# Altium project RpiNeoCore_Display.PrjPcb (part 2 of 3)

## Sheet AlarmRelay.SchDoc
size A3; SheetNumber: 6; SheetTotal: 11
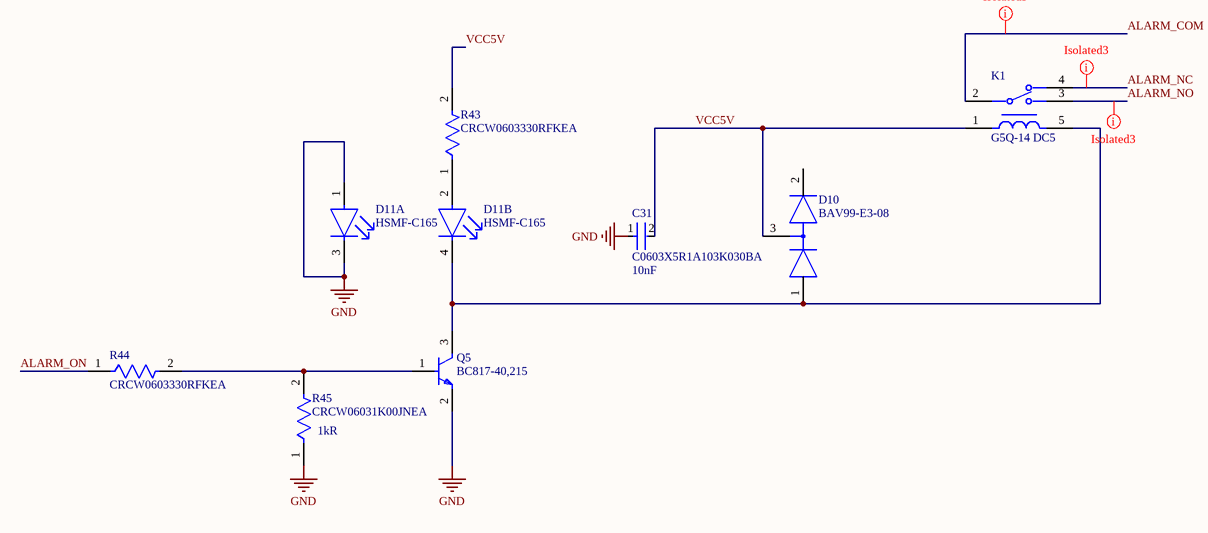
[diagram p5: AlarmRelay.SchDoc]

### Parts
C31  C0603X5R1A103K030BA  Capacitance: 10nF  [FP-C0603-030-0_03-MFG]
D10  BAV99-E3-08  [FP-6_541-5014_01-4-MFG]
D11  HSMF-C165  [FP-HSMF-C165-MFG]  (parts A,B of 2)
K1  G5Q-14 DC5  [FP-G5Q-14_DC5-MFG]
Q5  BC817-40,215  [FP-SOT23-MFG]
R43  CRCW0603330RFKEA  [FP-CRCW0603-e3-MFG]
R44  CRCW0603330RFKEA  [FP-CRCW0603-e3-MFG]
R45  CRCW06031K00JNEA  Resistance: 1kR  [FP-CRCW0603-e3-IPC_C]

### Nets
GND: C31.1 D11.1(GREEN_A) D11.3(GREEN_C) Q5.2(E) R45.1
ALARM_COM: K1.2
ALARM_NC: K1.4
ALARM_NO: K1.3
ALARM_ON: R44.1
VCC5V: C31.2 D10.3 K1.1 R43.2
NetD10_1: D10.1 D11.4(RED_C) K1.5 Q5.3(C)
NetD11_2: D11.2(RED_A) R43.1
NetQ5_1: Q5.1(B) R44.2 R45.2

Not connected (* = marked no-connect by the designer): D10 2

### Layout directives
net class Isolated3: ALARM_COM, ALARM_NC, ALARM_NO

### Library data of the parts
C31 = CMP-08246-002714-1: Multilayer Ceramic Capacitors 10nF ±10% 10V X5R SMD 0201; Dissipation Factor: 5%; Case Code (Imperial): 0201; Tolerance: 10%; Voltage: 10V; Case/Package: 0201; Width: 0.012inch; Series: C; Construction: Flat; Lead Free: Lead Free; Dielectric: X5R; Depth: 0.3mm; Mount: Surface Mount; Number of Pins: 2; Voltage Rating (DC): 10V; Radiation Hardening: No; Length: 0.6mm; Resistor Type: Ceramic; Dielectric Material: Ceramic; Packaging: Tape and Reel; Height: 0.3mm; Package Quantity: 1; RoHS Compliant: Yes; Thickness: 0.013inch; Min Operating Temperature: -55°C; Voltage Rating: 10V; Case Code (Metric): 0603; Weight: 6E-06oz; Max Operating Temperature: 85°C; Termination: SMD/SMT
D10 = CMP-02540-000013-1: DIODE ARRAY GP 70V 150MA SOT23; Manufacturer: Vishay; Max Surge Forward Current: 1A; Value: 1.5pF; Max Junction Temp: +150°C; Automotive Grade: NA; Forward Current: 250mA; Peak Reverse Current: 2.5uA; Digikey Description: DIODE ARRAY GP 70V 150MA SOT23; Device Class L2: Diodes; Category: Diode; Temperature: -55°C to +150°C; Octopart: https://octopart.com/bav99-e3-08-vishay-46456629; Temperature Range Low: -55°C; Package: 6.541-5014.01-4; ComponentLink2Description: Datasheet; RoHS: TRUE; ComponentLink2URL: http://www.vishay.com/docs/85718/bav99.pdf; Ipc Land Pattern Name: SOT95P248X102-3; Height: 1.15mm; Reverse Voltage: 70V; Capacitance: 1.5pF; Automotive: No; Temperature Range High: +150°C; Device Class L1: Discrete Semiconductors; Mouser Description: Diodes - General Purpose, Power, Switching 70V 250mA 4.5A IFSM Dual Series; Manufacturer Part Number: BAV99-E3-08; Lead Free: Yes; Device Class L3: Rectifier Diodes; Max Repetitive Reverse Voltage: 70V
D11 = CMP-2000-06424-2: LED GREEN/RED DIFFUSED 0603 SMD; Reverse Voltage: 5V; Dominant Wavelength: 621nm; Number of Elements: 2; Shape: Rectangular; Luminous Intensity: 10mcd; Forward Current: 20mA; Lens Color: White; Illumination Color: Green; Power Dissipation: 52mW; Wavelength: 572nm; Viewing Angle: 120°; Forward Voltage: 2.2V; Max Operating Temperature: 85°C; Lens Transparency: Diffused; Width: 0.8mm; Case/Package: 0603; Packaging: Tape and Reel; Case Code (Metric): 1608; Depth: 0.8mm; REACH SVHC: No SVHC; Number of LEDs: 2; Radiation Hardening: No; Lens Style: Rectangular; Color: Green; Case Code (Imperial): 0603; Min Operating Temperature: -40°C; Power Rating: 52mW; Number of Pins: 4; Number of Terminals: 4; Package Quantity: 1; Mount: Surface Mount; Height: 0.5mm; Length: 1.6mm; Lead Free: Lead Free; Test Current: 20mA
K1 = CMP-08822-000014-1: RELAY GEN PURPOSE SPDT 10A 5V; Manufacturer: Omron; Coil Type: Non-Latching; Coil Resistance: 63Ω; Number Of Contacts: 1; Coil Power: 400mW; Coil Current: 80mA; Standoff Height: 0.4mm; Device Class L2: Relays; Octopart: https://octopart.com/g5q-14+dc5-omron-71281; RoHS: TRUE; Temperature: -40°C to +105°C; Temperature Range High: +105°C; Category: Relay; ComponentLink2Description: Datasheet; Device Class L1: Electromechanical; Manufacturer Part Number: G5Q-14 DC5; ComponentLink2URL: https://omronfs.omron.com/en_US/ecb/products/pdf/en-g5q.pdf; Height: 16.2mm; Throw Configuration: SPDT; Current Rating: 10A; Mouser Description: Power Relay 5VDC 5(NO)/3(NC)DC/10(NO)/3(NC)AAC SPDT (20.3MM 10.3MM 16.2MM) Tht; Automotive: No; Device Class L3: Power Relays; Lead Free: Yes; Digikey Description: RELAY GEN PURPOSE SPDT 10A 5V; Package: 0; Coil Voltage: 5V; Temperature Range Low: -40°C; Ambient Temperature Range High: +105°C; Ambient Temperature Range Low: -40°C; Switching Current: 10A
Q5 = CMP-14406-000007-1: TRANS NPN 45V 0.5A SOT23; Manufacturer: Nexperia; Collector Emitter Saturation Voltage: 700mV; Power Dissipation: 250mW; Collector Base Voltage: 50V; Unity Gain Freq: 100MHz; Hfe Max: 600; Rthja Max: 500K/W; Emitter Base Voltage: 5V; Max Collector Current: 500mA; Hfe Testvce: 1V; Automotive Grade: Grade 0; Hfe Min: 250; Max Junction Temp: +150°C; Number Of Npn: 1; Hfe Testic: 100mA; Octopart: https://octopart.com/bc817-40%2C215-nexperia-78739081; Lead Free: Yes; Ipc Land Pattern Name: SOT95P230X100-3; Manufacturer Part Number: BC817-40,215; RoHS: TRUE; Collector Emitter Breakdown Voltage: 45V; Digikey Description: TRANS NPN 45V 0.5A SOT23; ComponentLink2URL: https://assets.nexperia.com/documents/data-sheet/BC817_SER.pdf; Temperature Range High: +150°C; Mouser Description: BC817 Series 45 V 500 mA 250 mW SMT NPN General-Purpose Transistor - SOT-23-; Device Class L3: BJTs; Temperature: to +150°C; Height: 1.1mm; Automotive: Yes; Ambient Temperature Range Low: -65°C; Package: SOT23; Collector Emitter Voltage: 45V; Category: Trans; ComponentLink2Description: Datasheet; Device Class L2: Transistors; Ambient Temperature Range High: +150°C; Number Of Elements: 1; Device Class L1: Discrete Semiconductors; Footprint Url: https://assets.nexperia.com/documents/outline-drawing/SOT23.pdf
R43 R44 = CMP-1012-00454-3: RES Thick Film, 330Ω, 1%, 0.1W, 100ppm/°C, 0603; Voltage Rating: 75V; Max Power Dissipation: 100mW; Resistance: 330R; Depth: 0.85mm; Contact Plating: Tin; Package Quantity: 10; Termination: SMD/SMT; Tolerance: 1%; Height: 0.45mm; Number of Terminations: 2; Radiation Hardening: No; Features: Automotive AEC-Q200; Case/Package: 0603; Mount: Surface Mount; Case Code (Metric): 1608; Lead Free: Lead Free; Temperature Coefficient: 100ppm/°C; Weight: 7.1E-05oz; Military Standard: Not; Packaging: Tape and Reel; Max Operating Temperature: 155°C; Voltage Rating (DC): 75V; Length: 1.55mm; Min Operating Temperature: -55°C; Composition: Thick Film; Case Code (Imperial): 0603; Width: 0.033inch; Power Rating: 100mW
R45 = CMP-02407-007100-1: RES Thick Film, 1kΩ, 5%, 0.1W, 200ppm/°C, 0603; Power Rating: 100mW; Voltage Rating: 75V; Height: 0.02inch; Number of Terminations: 2; Radiation Hardening: No; Max Operating Temperature: 155°C; Packaging: Tape and Reel; Package Quantity: 1; Military Standard: Not; Case/Package: 0603; Weight: 7.1E-05oz; Tolerance: 5%; Temperature Coefficient: 200ppm/°C; Termination: SMD/SMT; Case Code (Metric): 1608; Length: 1.55mm; Min Operating Temperature: -55°C; Depth: 0.85mm; Composition: Thick Film; Width: 0.033inch; Number of Pins: 2; Contact Plating: Tin; Max Power Dissipation: 100mW; Voltage Rating (DC): 75V; Case Code (Imperial): 0603; Lead Free: Lead Free; Features: Automotive AEC-Q200

## Sheet AnalogInputs.SchDoc
size A3; SheetNumber: 7; SheetTotal: 11
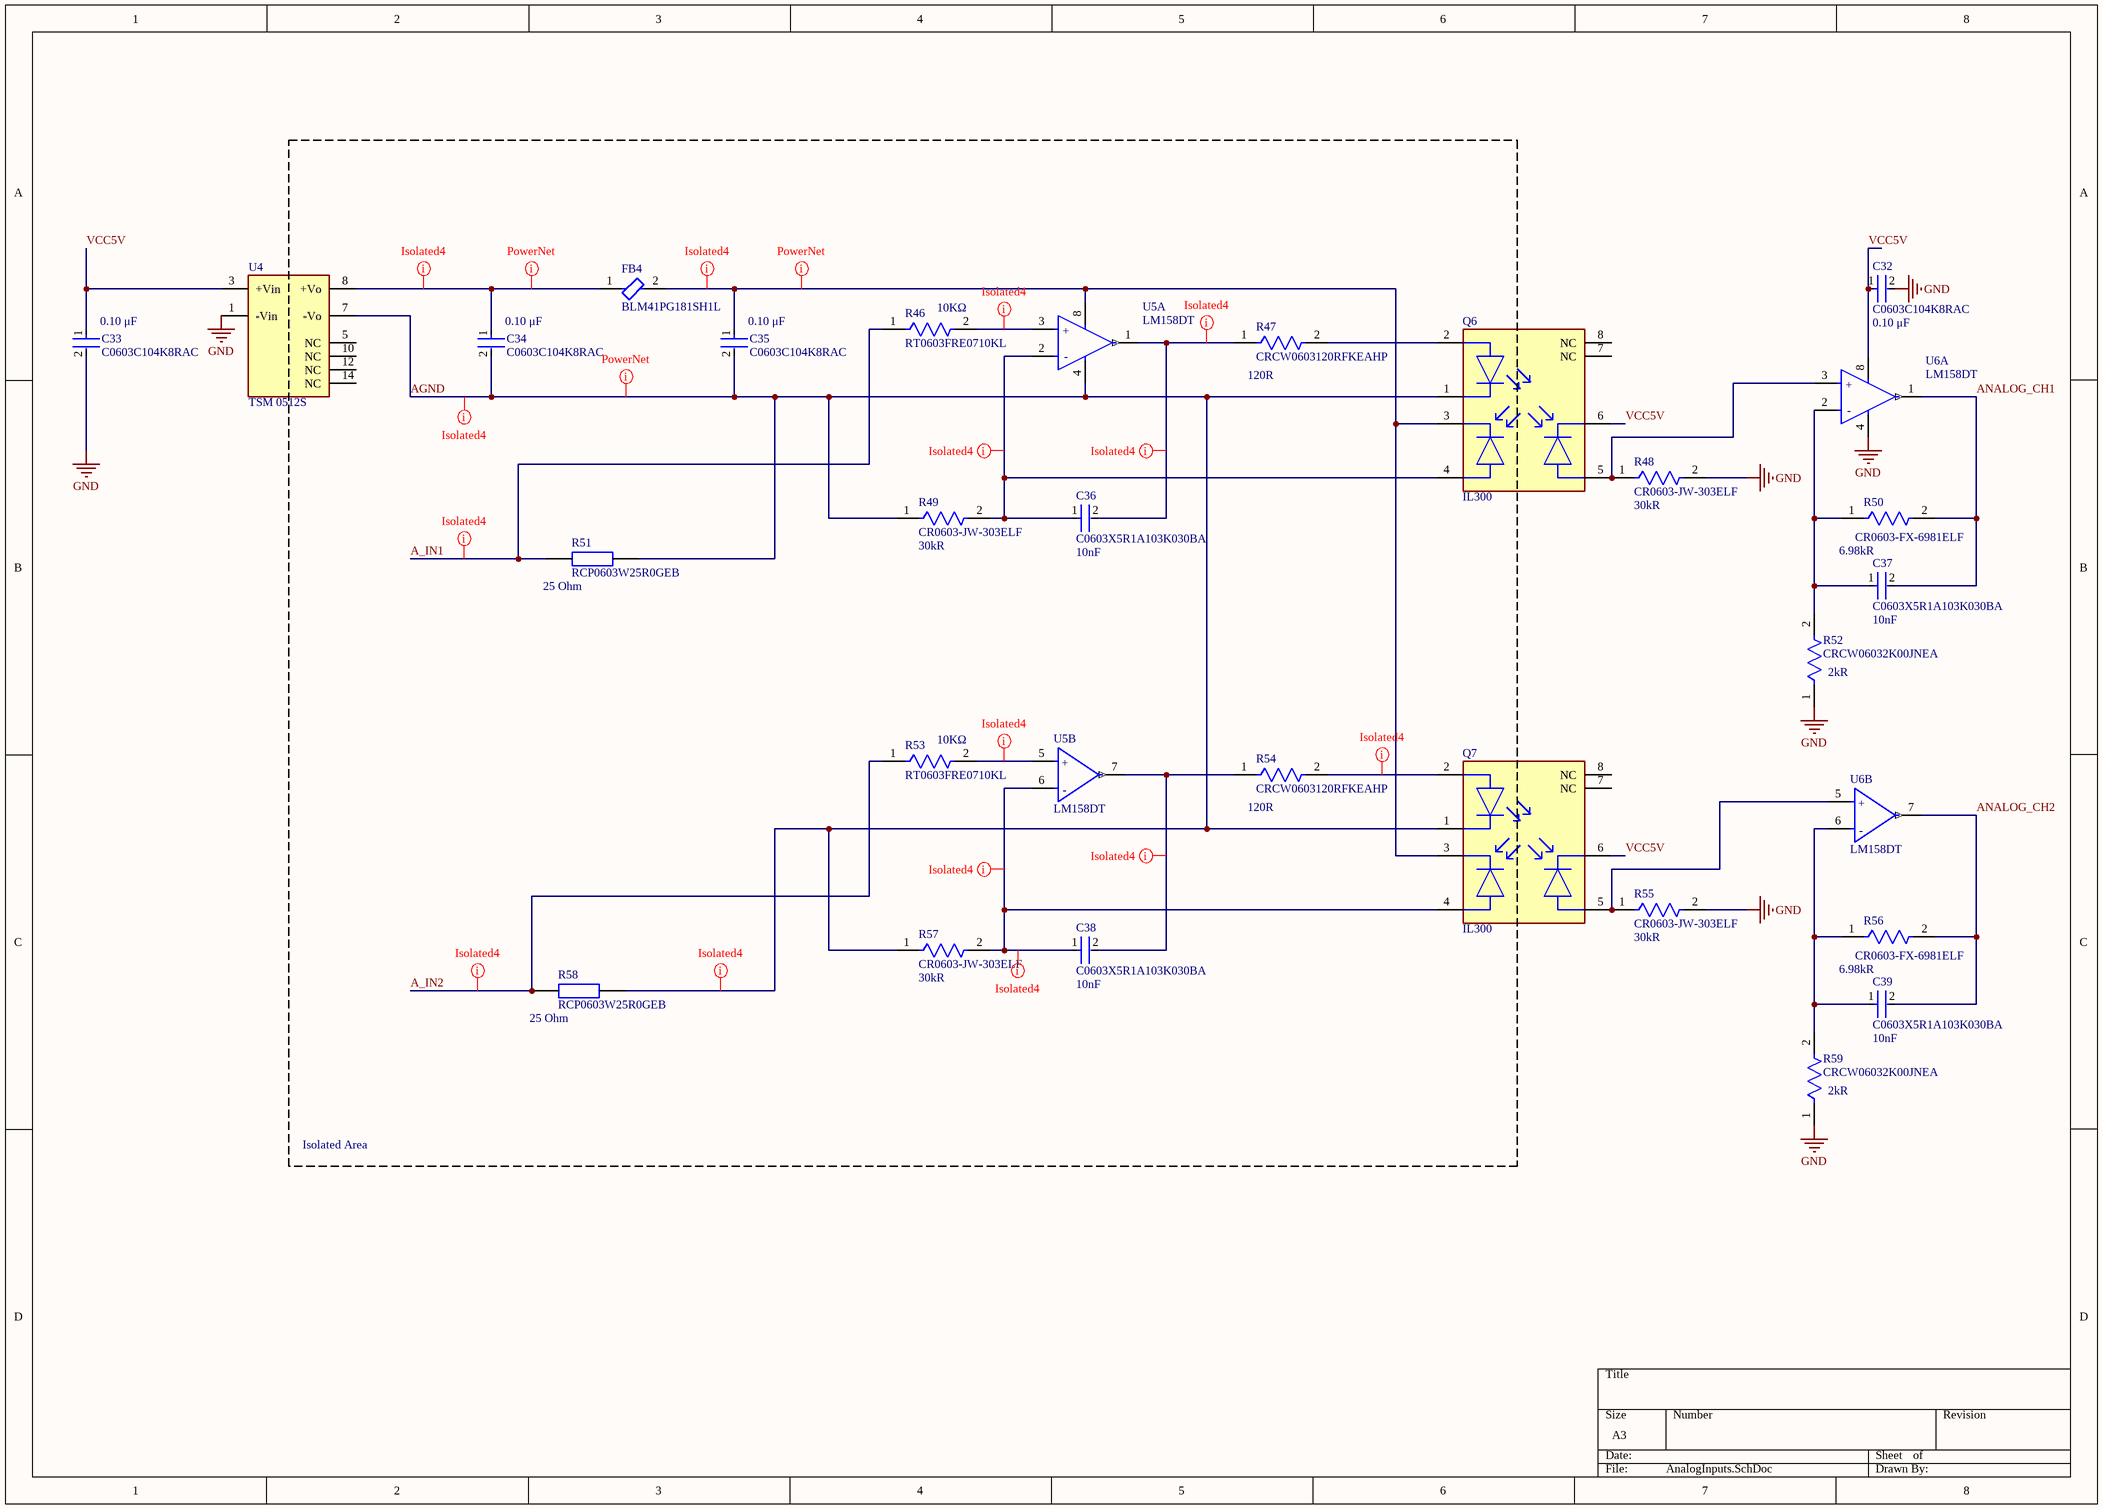
[diagram p6: AnalogInputs.SchDoc]

### Parts
C32  C0603C104K8RAC  Capacitance: 0.10 μF  [FP-C0603C-CF-MFG]
C33  C0603C104K8RAC  Capacitance: 0.10 μF  [FP-C0603C-CF-MFG]
C34  C0603C104K8RAC  Capacitance: 0.10 μF  [FP-C0603C-CF-MFG]
C35  C0603C104K8RAC  Capacitance: 0.10 μF  [FP-C0603C-CF-MFG]
C36  C0603X5R1A103K030BA  Capacitance: 10nF  [FP-C0603-030-0_03-MFG]
C37  C0603X5R1A103K030BA  Capacitance: 10nF  [FP-C0603-030-0_03-MFG]
C38  C0603X5R1A103K030BA  Capacitance: 10nF  [FP-C0603-030-0_03-MFG]
C39  C0603X5R1A103K030BA  Capacitance: 10nF  [FP-C0603-030-0_03-MFG]
FB4  BLM41PG181SH1L  [FP-BLM41-0_2-a1_2-MFG]
Q6  IL300  [FP-83265-MFG]
Q7  IL300  [FP-83265-MFG]
R46  RT0603FRE0710KL  value 10KΩ  [FP-RT0603-MFG]
R47  CRCW0603120RFKEAHP  Resistance: 120R  [FP-CRCW0603-HPe3-MFG]
R48  CR0603-JW-303ELF  Resistance: 30kR  [FP-CR0603-MFG]
R49  CR0603-JW-303ELF  Resistance: 30kR  [FP-CR0603-MFG]
R50  CR0603-FX-6981ELF  Resistance: 6.98kR  [FP-CR0603-IPC_B]
R51  RCP0603W25R0GEB  Resistance: 25 Ohm  [RESC1608X59N]
R52  CRCW06032K00JNEA  Resistance: 2kR  [FP-CRCW0603-e3-MFG]
R53  RT0603FRE0710KL  value 10KΩ  [FP-RT0603-MFG]
R54  CRCW0603120RFKEAHP  Resistance: 120R  [FP-CRCW0603-HPe3-MFG]
R55  CR0603-JW-303ELF  Resistance: 30kR  [FP-CR0603-MFG]
R56  CR0603-FX-6981ELF  Resistance: 6.98kR  [FP-CR0603-IPC_B]
R57  CR0603-JW-303ELF  Resistance: 30kR  [FP-CR0603-MFG]
R58  RCP0603W25R0GEB  Resistance: 25 Ohm  [RESC1608X59N]
R59  CRCW06032K00JNEA  Resistance: 2kR  [FP-CRCW0603-e3-MFG]
U4  TSM 0512S  [FP-TSM_0512S-MFG]
U5  LM158DT  [FP-SO8-IPC_C]  (parts A,B of 2)
U6  LM158DT  [FP-SO8-IPC_C]  (parts A,B of 2)

### Blocks framed on the sheet
Isolated Area: C34-C36 C38 FB4 R46 R47 R49 R51 R53 R54 R57 R58 U4 U5

### Nets
GND: C32.2 C33.2 R48.2 R52.1 R55.2 R59.1 U4.1(-Vin) U6.4(Vcc-)
A_IN1: R46.1 R51.1
A_IN2: R53.1 R58.1
AGND: C34.2 C35.2 Q6.1(1_CATHODE) Q7.1(1_CATHODE) R49.1 R51.2 R57.1 R58.2 U4.7(-Vo) U5.4(Vcc-)
ANALOG_CH1: C37.2 R50.2 U6.1(Out1)
ANALOG_CH2: C39.2 R56.2 U6.7(Out2)
VCC5V: C32.1 C33.1 Q6.6(3_CATHODE) Q7.6(3_CATHODE) U4.3(+Vin) U6.8(Vcc+)
NetC34_1: C34.1 FB4.1 U4.8(+Vo)
NetC35_1: C35.1 FB4.2 Q6.3(2_CATHODE) Q7.3(2_CATHODE) U5.8(Vcc+)
NetC36_1: C36.1 Q6.4(2_ANODE) R49.2 U5.2(In1-)
NetC36_2: C36.2 R47.1 U5.1(Out1)
NetC37_1: C37.1 R50.1 R52.2 U6.2(In1-)
NetC38_1: C38.1 Q7.4(2_ANODE) R57.2 U5.6(In2-)
NetC38_2: C38.2 R54.1 U5.7(Out2)
NetC39_1: C39.1 R56.1 R59.2 U6.6(In2-)
NetQ6_2: Q6.2(1_ANODE) R47.2
NetQ6_5: Q6.5(3_ANODE) R48.1 U6.3(In1+)
NetQ7_2: Q7.2(1_ANODE) R54.2
NetQ7_5: Q7.5(3_ANODE) R55.1 U6.5(In2+)
NetR46_2: R46.2 U5.3(In1+)
NetR53_2: R53.2 U5.5(In2+)

Not connected (* = marked no-connect by the designer): Q6 7(NC) 8(NC); Q7 7(NC) 8(NC); U4 5(NC) 10(NC) 12(NC) 14(NC)

### Layout directives
net class Isolated4: A_IN1, A_IN2, AGND, NetC34_1, NetC35_1, NetC36_1, NetC36_2, NetC38_1, NetC38_2, NetQ7_2, NetR46_2, NetR53_2
net class Power: AGND, NetC34_1, NetC35_1

### Notes on the sheet
- (in symbol CMP-2000-06544-2, part A) +; -
- (in symbol CMP-2000-06544-2, part B) +; -

### Library data of the parts
C32-C35 = CMP-03020-006081-2: C0603 0.10 μF X7R 30ppm/°C 10.00% 10 V; Manufacturer: KEMET; Value: 0.10 μF; Material: Ceramic; Automotive Grade: Grade 1; Voltage Rating: 10 V; Tolerance: 0.1; Automotive: Yes; Device Class L2: Capacitors; Height: 0.87mm; Temperature Range High: +125°C; Temperature Coefficient: 30ppm/°C; Temperature Range Low: -55°C; Package: C0603C-CF; Lead Free: Yes; Octopart: https://octopart.com/c0603c104k8rac-kemet-1325403; Manufacturer Part Number: C0603C104K8RAC; Temperature: -55°C to +125°C; Mouser Description: .1UF 10V 10% 0603; RoHS: TRUE; ComponentLink2URL: https://api.kemet.com/component-edge/download/datasheet/C0603C100J5GACAUTO.pdf; ComponentLink2Description: Datasheet; Temperature Characteristic: X7R; Device Class L1: Passive Components; Category: Cap; Device Class L3: Ceramic Capacitors
C36-C39 = CMP-08246-002714-1: as C31 on sheet AlarmRelay; Case Code (Imperial): 0201; Tolerance: 10%; Voltage: 10V; Case/Package: 0201; Width: 0.012inch; Series: C; Construction: Flat; Lead Free: Lead Free; Dielectric: X5R; Depth: 0.3mm; Mount: Surface Mount; Number of Pins: 2; Voltage Rating (DC): 10V; Radiation Hardening: No; Length: 0.6mm; Resistor Type: Ceramic; Dielectric Material: Ceramic; Packaging: Tape and Reel; Height: 0.3mm; Package Quantity: 1; RoHS Compliant: Yes; Thickness: 0.013inch; Min Operating Temperature: -55°C; Voltage Rating: 10V; Case Code (Metric): 0603; Weight: 6E-06oz; Max Operating Temperature: 85°C; Termination: SMD/SMT
FB4 = CMP-06046-002023-1: Ferrite Bead, 1806, 180Ω @ 100MHz, 25%, 0.02Ω, 3.5A; Impedance: 180R; Number of Lines: 1; Max DC Current: 50mA; DC Resistance (DCR): 20mR; Mount: Surface Mount; Length: 4.5mm; Tolerance: 25%; Series: EMIFIL®, BLM41P; Package Quantity: 2500; Min Operating Temperature: -55°C; Max Operating Temperature: 125°C; Height: 0.071inch; Packaging: Tape and Reel; Contact Plating: Tin; Test Frequency: 100MHz; Ratings: AEC-Q200; Case Code (Metric): 4516; Termination: SMD/SMT; Case Code (Imperial): 1806; Width: 0.063inch; Max Current Rating: 3.5A; Case/Package: 1806
Q6 Q7 = CMP-2000-06452-2: OPTOISO 5.3KV LINEAR PHVOLT 8DIP; Manufacturer: Vishay; Standoff Height: 0.527mm; Forward Current: 10mA; Isolation Voltage: 4420Vrms; Forward Voltage: 1.25V; Reverse Voltage: 5V; Power Dissipation: 210mW; Max Junction Temp: +100°C; Temperature: to +100°C; Height: 4.699mm; Manufacturer Part Number: IL300; Automotive: No; Device Class L2: Optocouplers; Octopart: https://octopart.com/il300-vishay-39692656; ComponentLink2Description: Datasheet; Footprint Url: http://www.vishay.com/docs/83265/83265.pdf; Device Class L1: Optoelectronics; ComponentLink2URL: https://www.vishay.com/docs/83622/il300.pdf; RoHS: TRUE; Device Class L3: unset; Ipc Land Pattern Name: DIP762W51P254L1016H426Q8; Ambient Temperature Range Low: -55°C; Lead Free: Yes; Package: 83265; Ambient Temperature Range High: +100°C; Category: Trans; Digikey Description: OPTOISO 5.3KV LINEAR PHVOLT 8DIP; Temperature Range High: +100°C; Mouser Description: Optocoupler DC-IN 1-CH Linear Photovoltaic DC-OUT 8-Pin PDIP-8A
R46 R53 = CMP-03412-005349-1: RES SMD 10K OHM 1% 1/10W 0603; Manufacturer: Yageo; Temperature Coefficient: 50 ppm/°C; Power Rating: 0.1W; Tolerance: 0.01; Voltage Rating: 75V; RoHS: TRUE; Category: Res; Automotive: No; Digikey Description: RES SMD 10K OHM 1% 1/10W 0603; ComponentLink2Description: Datasheet; Octopart: https://octopart.com/rt0603fre0710kl-yageo-40009243; ComponentLink2URL: http://www.yageo.com/documents/recent/PYu-RT_1-to-0.01_RoHS_L_9.pdf; Device Class L3: Chip SMD Resistors; Device Class L1: Passive Components; Temperature Range High: +155°C; Height: 0.55mm; Composition: Thin Film; Ipc Land Pattern Name: RESC16080X45; Series: RT; Package: RT0603; Resistance: 10KΩ; Footprint Url: http://www.yageo.com/exep/pages/download/literatures/PYu-R_Mount_10.pdf; Temperature: -55°C to +155°C; Temperature Range Low: -55°C; Lead Free: Yes; Device Class L2: Resistors; Mouser Description: Thin Film Resistors - SMD 10K ohm 1% 1/10W; Manufacturer Part Number: RT0603FRE0710KL
R47 R54 = CMP-02407-008828-1: RES Thick Film, 120Ω, 1%, 0.33W, 100ppm/°C, 0603; Max Power Dissipation: 250mW; Voltage Rating: 75V; Military Standard: Not; Case Code (Metric): 1608; Depth: 0.85mm; Case Code (Imperial): 0603; Composition: Thick Film; Power Rating: 250mW; Number of Terminations: 2; Max Operating Temperature: 155°C; Temperature Coefficient: 100ppm/°C; Tolerance: 1%; Radiation Hardening: No; Width: 0.033inch; Min Operating Temperature: -55°C; Height: 0.022inch; Termination: SMD/SMT; Features: Automotive AEC-Q200; Length: 1.6mm; Package Quantity: 5000; Packaging: Tape and Reel; Case/Package: 0603; Contact Plating: Tin
R48 R49 R55 R57 = CMP-07231-001566-1: Thick Film Chip Resistors 0603 30kΩ 0.1W 5% 200ppm/°C; Max Power Dissipation: 100mW; Voltage Rating: 50V; Tolerance: 5%; Min Operating Temperature: -55°C; Height: 0.022inch; Depth: 0.8mm; Termination: SMD/SMT; Max Operating Temperature: 155°C; Contact Plating: Tin; Power Rating: 100mW; Width: 0.8mm; Packaging: Tape and Reel; Case Code (Imperial): 0603; Thickness: 457um; Package Quantity: 5000; Radiation Hardening: No; Temperature Coefficient: 200ppm/°C; Case/Package: 0603; Composition: Thick Film; Case Code (Metric): 1608; Length: 1.6mm; Number of Terminations: 2; Mount: Surface Mount; Military Standard: Not; Features: Moisture Resistant
R50 R56 = CMP-07231-001360-1: Thick Film Chip Resistors 0603 6.98kΩ 0.1W 1% 100ppm/°C; Power Rating: 100mW; Voltage Rating: 50V; Depth: 0.8mm; Package Quantity: 5000; Number of Terminations: 2; Case Code (Metric): 1608; Radiation Hardening: No; Width: 0.031inch; Packaging: Tape and Reel; Termination: SMD/SMT; Mount: Surface Mount; Features: Moisture Resistant; Composition: Thick Film; Min Operating Temperature: -55°C; Case Code (Imperial): 0603; Height: 0.022inch; Length: 1.6mm; Thickness: 457um; Max Operating Temperature: 155°C; Contact Plating: Tin; Tolerance: 1%; Temperature Coefficient: 100ppm/°C; Case/Package: 0603; Max Power Dissipation: 100mW; Military Standard: Not
R51 R58 = RCP0603W25R0GEB: Vishay 25 0603 (1608M) Thick Film SMD Resistor +/-2% 1.5W - RCP0603W25R0GEB; Geometry.Height: 0.59mm; Mouser Part Number: *; Mouser Price/Stock: *; Manufacturer_Name: Vishay; Manufacturer_Part_Number: RCP0603W25R0GEB; Datasheet Link: *
R52 R59 = CMP-2000-03163-2: RES Thick Film, 2kΩ, 5%, 0.1W, 200ppm/°C, 0603; Power Rating: 100mW; Working Voltage: 75V; Min Operating Temperature: -55°C; Package Quantity: 1; Contact Plating: Tin; Number of Terminations: 2; Depth: 0.85mm; Radiation Hardening: No; Weight: 7.1E-05oz; Case Code (Imperial): 0603; Tolerance: 5%; Length: 1.55mm; Temperature Coefficient: 200ppm/°C; Width: 0.033inch; Mount: Surface Mount; Case Code (Metric): 1608; Voltage Rating: 75V; Height: 0.45mm; Case/Package: 0603; Military Standard: Not; Features: Automotive AEC-Q200; Number of Pins: 2; Lead Free: Lead Free; Composition: Thick Film; Packaging: Tape and Reel; Max Operating Temperature: 155°C; Voltage Rating (DC): 75V; Max Power Dissipation: 100mW; Termination: SMD/SMT
U4 = CMP-49942-000007-1: DC DC CONVERTER 12V 960MW; Manufacturer: Tracopower; Nominal Supply Current: 110mA; Switching Topology: Boost; Min Supply Voltage: 4.5V; Switching Frequency: 100kHz; Output Type: Fixed; Standoff Height: 0mm; Number Of Outputs: 1; Output Current: 80mA; Max Supply Voltage: 5.5V; Octopart: https://octopart.com/tsm+0512s-tracopower-7394392; Manufacturer Part Number: TSM 0512S; ComponentLink2URL: https://docs.rs-online.com/a71b/0900766b816ed9c3.pdf; Lead Free: Yes; Temperature: -40°C to +85°C; Device Class L3: Voltage Regulators - Switching; Output Voltage: 12V; Temperature Range High: +85°C; Height: 7.55mm; RoHS: TRUE; Device Class L2: Power Management ICs; Digikey Description: DC DC CONVERTER 12V 960MW; ComponentLink2Description: Datasheet; Automotive: No; Category: IC; Temperature Range Low: -40°C; Device Class L1: Integrated Circuits (ICs); Package: 0
U5 U6 = CMP-2000-06544-2: IC OPAMP GP 2 CIRCUIT 8SO; Manufacturer: STMicroelectronics; Standoff Height: 0.1mm; Input Offset Voltage: 2mV; Output Current Per Channel: 40mA; Max Dual Supply Voltage: 15V; Max Supply Voltage: 30V; Nominal Supply Current: 50-20000uA; Input Bias Current: 0.02uA; Min Dual Supply Voltage: 1.5V; Min Supply Voltage: 3V; Voltage Gain: 100V/mV; Number Of Channels: 2; Max Junction Temp: +150°C; Lead Free: Yes; Device Class L2: Linear ICs; Temperature Range Low: -55°C; RoHS: TRUE; Temperature Range High: +125°C; Automotive: No; Height: 1.75mm; Device Class L1: Integrated Circuits (ICs); Mouser Description: Operational Amplifiers - Op Amps Low PWR Dual OP AMP 100dB 1.1 MHz 20nA; Temperature: -55°C to +125°C; Digikey Description: IC OPAMP GP 2 CIRCUIT 8SO; Device Class L3: Amplifiers - Op Amps; Manufacturer Part Number: LM158DT; ComponentLink2Description: Datasheet; Package: SO8; ComponentLink2URL: https://www.st.com/content/ccc/resource/technical/document/datasheet/61/46/87/01/98/ed/44/c5/CD00000464.pdf/files/CD00000464.pdf/jcr:content/translations/en.CD00000464.pdf; Octopart: https://octopart.com/lm158dt-stmicroelectronics-11026426

## Sheet SerialCommunication.SchDoc
size A3; SheetNumber: 8; SheetTotal: 11
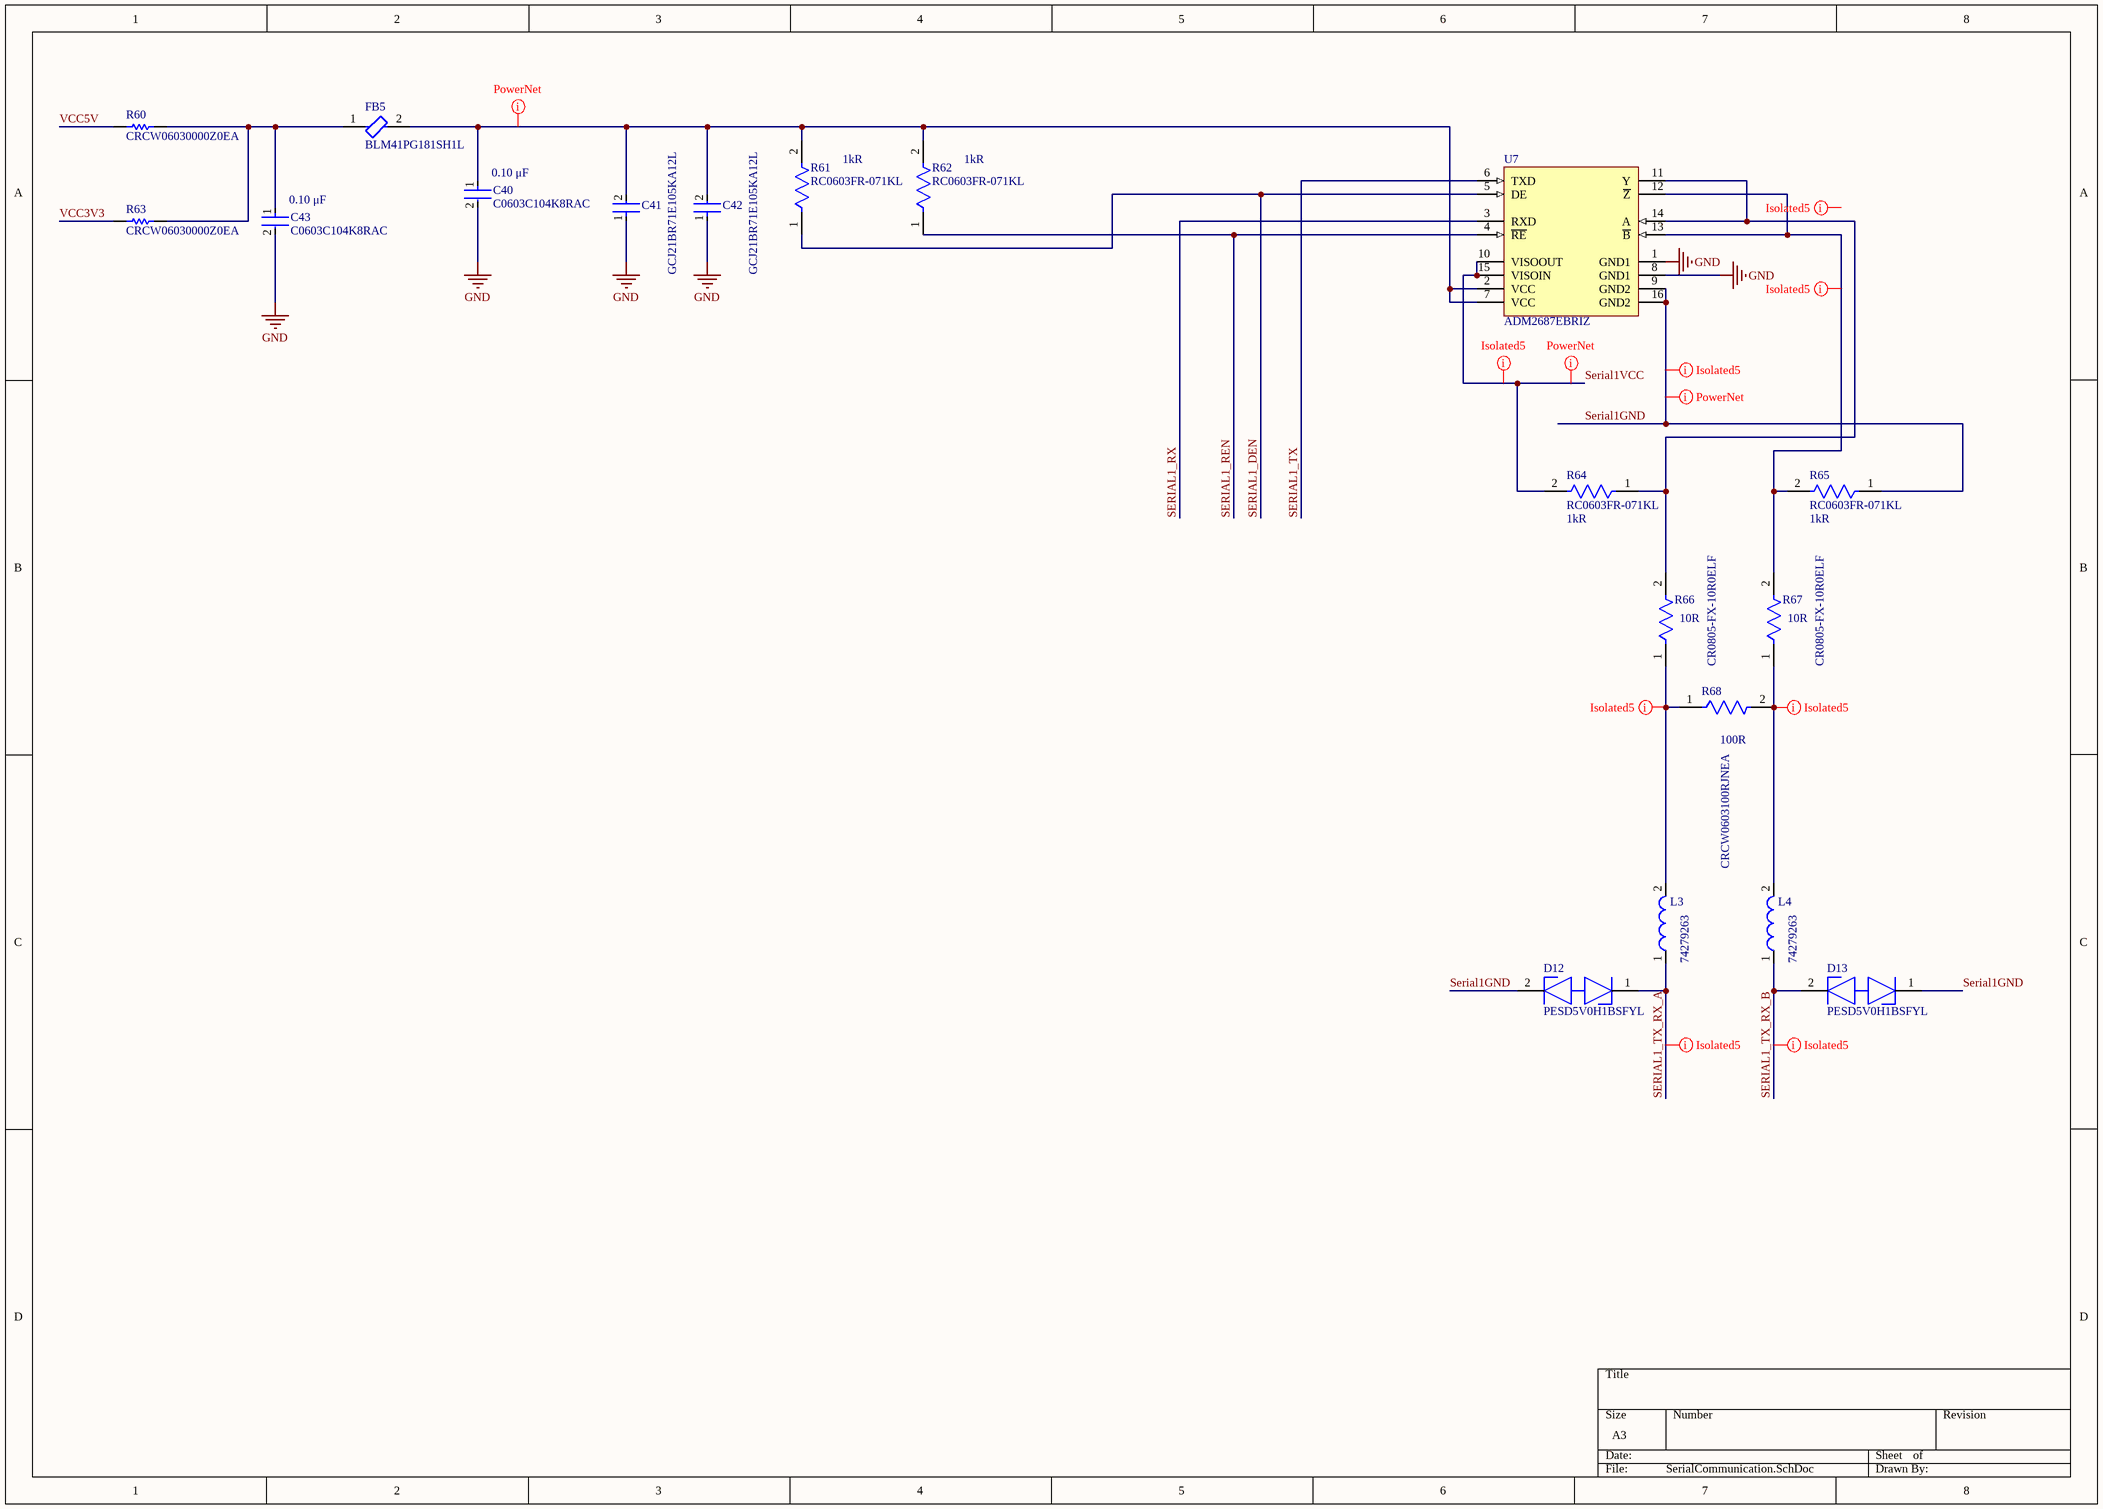
[diagram p7: SerialCommunication.SchDoc]

### Parts
C40  C0603C104K8RAC  Capacitance: 0.10 μF  [FP-C0603C-CF-MFG]
C41  GCJ21BR71E105KA12L  [FP-GCJ21B-0_3-MFG]
C42  GCJ21BR71E105KA12L  [FP-GCJ21B-0_3-MFG]
C43  C0603C104K8RAC  Capacitance: 0.10 μF  [FP-C0603C-CF-MFG]
D12  PESD5V0H1BSFYL  [FP-SOD962-2-MFG]
D13  PESD5V0H1BSFYL  [FP-SOD962-2-MFG]
FB5  BLM41PG181SH1L  [FP-BLM41-0_2-a1_2-MFG]
L3  74279263  [SMD-0603]
L4  74279263  [SMD-0603]
R60  CRCW06030000Z0EA  [RESC1609X50X30NL8T20]
R61  RC0603FR-071KL  Resistance: 1kR  [FP-RC0603-0_55-IPC_C]
R62  RC0603FR-071KL  Resistance: 1kR  [FP-RC0603-0_55-IPC_C]
R63  CRCW06030000Z0EA  [RESC1609X50X30NL8T20]
R64  RC0603FR-071KL  Resistance: 1kR  [FP-RC0603-0_55-IPC_C]
R65  RC0603FR-071KL  Resistance: 1kR  [FP-RC0603-0_55-IPC_C]
R66  CR0805-FX-10R0ELF  Resistance: 10R  [FP-CR0805-IPC_B]
R67  CR0805-FX-10R0ELF  Resistance: 10R  [FP-CR0805-IPC_B]
R68  CRCW0603100RJNEA  Resistance: 100R  [FP-CRCW0603-e3-IPC_B]
U7  ADM2687EBRIZ  [ADI-RI-16-2_L]

### Nets
GND: C40.2 C41.1 C42.1 C43.2 U7.1(GND1) U7.8(GND1)
SERIAL1_DEN: R61.1 U7.5(DE)
SERIAL1_REN: R62.1 U7.4(~{RE})
SERIAL1_RX: U7.3(RXD)
SERIAL1_TX: U7.6(TXD)
SERIAL1_TX_RX_A: D12.1(K1) L3.1
SERIAL1_TX_RX_B: D13.2(K2) L4.1
Serial1GND: D12.2(K2) D13.1(K1) R65.1 U7.9(GND2) U7.16(GND2)
Serial1VCC: R64.2 U7.10(VISOOUT) U7.15(VISOIN)
VCC3V3: R63.1
VCC5V: R60.1
NetC40_1: C40.1 C41.2 C42.2 FB5.2 R61.2 R62.2 U7.2(VCC) U7.7(VCC)
NetC43_1: C43.1 FB5.1 R60.2 R63.2
NetL3_2: L3.2 R66.1 R68.1
NetL4_2: L4.2 R67.1 R68.2
NetR64_1: R64.1 R66.2 U7.11(Y) U7.14(A)
NetR65_2: R65.2 R67.2 U7.12(~{Z}) U7.13(~{B})

### Layout directives
net class Isolated5: (no net found under the mark), NetL3_2, NetL4_2, NetR65_2, SERIAL1_TX_RX_A, SERIAL1_TX_RX_B, Serial1GND, Serial1VCC
net class Power: NetC40_1, Serial1GND, Serial1VCC

### Library data of the parts
C40 C43 = CMP-03020-006081-2: as C32 on sheet AnalogInputs; Automotive: Yes; Device Class L2: Capacitors; Height: 0.87mm; Temperature Range High: +125°C; Temperature Coefficient: 30ppm/°C; Temperature Range Low: -55°C; Package: C0603C-CF; Lead Free: Yes; Octopart: https://octopart.com/c0603c104k8rac-kemet-1325403; Manufacturer Part Number: C0603C104K8RAC; Temperature: -55°C to +125°C; Mouser Description: .1UF 10V 10% 0603; RoHS: TRUE; ComponentLink2URL: https://api.kemet.com/component-edge/download/datasheet/C0603C100J5GACAUTO.pdf; ComponentLink2Description: Datasheet; Temperature Characteristic: X7R; Device Class L1: Passive Components; Category: Cap; Device Class L3: Ceramic Capacitors
C41 C42 = CMP-2007-03211-2: Multilayer Ceramic Capacitors MLCC - SMD/SMT 0805 1uF 10%, 25VDC,  X7R 15%; Voltage Rating (DC): 25V; Package Quantity: 3000; Depth: 1.25mm; Packaging: Tape and Reel; Voltage Rating: 25V; Max Operating Temperature: 125°C; Ratings: AEC-Q200; Width: 1.25mm; Min Operating Temperature: -55°C; Termination: SMD/SMT; Lead Free: Lead Free; Dielectric: X7R; Length: 2mm; Thickness: 0.057inch; Capacitance: 1uF; Tolerance: 10%; Case Code (Metric): 2012; Case/Package: 0805; Mount: Surface Mount; Features: Soft Termination; Case Code (Imperial): 0805
D12 D13 = CMP-14436-000004-1: TVS DIODE 5V 5V DSN0603-2; Manufacturer: Nexperia; Breakdown Voltage: 6V; Direction: Bidirectional; Value: 0.15pF; Clamping Voltage: 6.3V; Number Of Channels: 1; Peak Pulse Current: 7A; Max Junction Temp: +150°C; Lead Free: Yes; Reverse Standoff Voltage: 5V; Footprint Url: https://assets.nexperia.com/documents/outline-drawing/SOD962-2.pdf; ComponentLink2Description: Datasheet; Height: 0.32mm; Ambient Temperature Range Low: -40°C; Manufacturer Part Number: PESD5V0H1BSFYL; Octopart: https://octopart.com/pesd5v0h1bsfyl-nexperia-78741149; Ambient Temperature Range High: +125°C; RoHS: TRUE; Temperature: to +150°C; Capacitance: 0.15pF; ComponentLink2URL: https://assets.nexperia.com/documents/data-sheet/PESD5V0H1BSF.pdf; Temperature Range High: +150°C; Device Class L2: TVS Diodes; Digikey Description: TVS DIODE 5V 5V DSN0603-2; Category: Diode; Device Class L3: unset; Device Class L1: Circuit Protection; Package: SOD962-2; Automotive: No
FB5 = CMP-06046-002023-1: as FB4 on sheet AnalogInputs; Mount: Surface Mount; Length: 4.5mm; Tolerance: 25%; Series: EMIFIL®, BLM41P; Package Quantity: 2500; Min Operating Temperature: -55°C; Max Operating Temperature: 125°C; Height: 0.071inch; Packaging: Tape and Reel; Contact Plating: Tin; Test Frequency: 100MHz; Ratings: AEC-Q200; Case Code (Metric): 4516; Termination: SMD/SMT; Case Code (Imperial): 1806; Width: 0.063inch; Max Current Rating: 3.5A; Case/Package: 1806
L3 L4 = CMP-0220-00148-1: SMD EMI Suppression Ferrite Bead WE-CBF, Z = 220 Ohm; Impedance: 220 Ohm; PackageVersion: 2009; ComponentLink2URL: http://www.we-online.de/katalog/media/pdf/74279263.pdf; PackageDescription: Chip Inductor, 2-Leads, Body 1.6 x 0.8 mm; PackageReference: SMD-0603; ComponentLink1URL: http://www.we-online.com; ComponentLink2Description: Datasheet; ComponentLink1Description: Manufacturer Link; DatasheetVersion: Dec-2005
R60 R63 = CMP-2000-03816-5: Chip Resistor, 0 Ohm, Jumper, 100 mW, -55 to 155 degC, 0603 (1608 Metric), RoHS, Tape and Reel; Manufacturer: Vishay Semiconductor; Voltage Rating: 75 V; Package Quantity: 5000; DatasheetVersion: 06/2012; Min Operating Temperature: -55 degC; ComponentLink1URL: http://www.vishay.com/; Mounting Technology: Surface Mount; Height: 0.45 mm; ComponentLink1Description: Manufacturer URL; REACH SVHC: Unknown; PackageReference: 0603; Packaging: Tape and Reel; Max Operating Temperature: 155 degC; Mount: Surface Mount; ComponentLink2Description: Datasheet; PackageDescription: 2-Pin Surface Mount Device, Body 1.575 x 0.85 mm; Length: 1.55 mm; ComponentLink2URL: http://www.vishay.com/docs/20035/dcrcwe3.pdf; Pins: 2; RoHSCompliant: true
R61 R62 R64 R65 = CMP-1659-00009-5: RES 1K OHM 1% 1/10W 0603; Voltage Rating: 50V; Power Rating: 100mW; Temperature Coefficient: 100ppm/°C; Military Standard: Not; REACH SVHC: No SVHC; Size Code: 0603; Features: Moisture Resistant; Number of Terminations: 2; Technology: THICK FILM; Series: RC; Case Code (Metric): 1608; Resistance Tolerance: 1%; Resistor Type: Thick Film; Termination: SMD/SMT; Contact Plating: Tin; Radiation Hardening: No; Min Operating Temperature: -55°C; Max Operating Temperature: 155°C; Packaging: Tape and Reel; Max Power Dissipation: 100mW; RoHS Compliant: Yes; Height: 0.45mm; Lead Free: Lead Free; Case/Package: 0603; Length: 1.6mm; Tolerance: 1%; Case Code (Imperial): 0603; Construction: Rectangular; Depth: 0.8mm
R66 R67 = CMP-07231-004657-1: Thick Film Chip Resistors 0805 10Ω 0.125W 1% 100ppm/°C; Voltage Rating (DC): 150V; Power Rating: 125mW; Tolerance: 1%; Min Operating Temperature: -55°C; Length: 2mm; Case Code (Metric): 2012; Temperature Coefficient: 100ppm/°C; Height: 0.5mm; Max Operating Temperature: 155°C; Case/Package: 0805; Width: 1.25mm; Composition: Thick Film; Contact Plating: Tin; Termination: SMD/SMT; Packaging: Tape and Reel; REACH SVHC: No SVHC; Number of Pins: 2; Package Quantity: 5000; Mount: Surface Mount; Military Standard: Not; Thickness: 508um; Case Code (Imperial): 0805; Depth: 1.25mm; Radiation Hardening: No; Voltage Rating: 150V
R68 = CMP-2000-03827-2: RES Thick Film, 100Ω, 5%, 0.1W, 200ppm/°C, 0603; Power Rating: 100mW; Voltage Rating: 75V; Weight: 7.1E-05oz; Max Operating Temperature: 155°C; Military Standard: Not; Case Code (Imperial): 0603; Case/Package: 0603; Packaging: Tape and Reel; Number of Terminations: 2; Package Quantity: 1; Radiation Hardening: No; Termination: SMD/SMT; Case Code (Metric): 1608; Min Operating Temperature: -55°C; Height: 0.02inch; Length: 1.55mm; Tolerance: 5%; Width: 0.85mm; Contact Plating: Tin; Max Power Dissipation: 100mW; Features: Automotive AEC-Q200; Composition: Thick Film; Temperature Coefficient: 200ppm/°C; Depth: 0.85mm
U7 = CMP-0528-00004-2: 5 kV rms Signal and Power Isolated, RS-485 I/O pins, 500 kbps, -40 to 85 degC, 16-Pin SOIC (RI-16-2), Pb-Free; Manufacturer: Analog Devices; Pwr Supply (Vnom): +3.3, +5; Insulation Rating (kVrms): 5 KV rms; # of Nodes On Bus: 256; Driver/Receiver Enable: Yes; ESD Protection V: 15 kV; DataRate RS-485: 500 Kbps; RoHS: TRUE; Mounting Technology: Surface Mount; PackageDescription: 16-Pin Standard Small Outline Package, Body 12.75 x 7.5 mm, Pitch 1.27 mm; DatasheetVersion: Rev. A; ComponentLink3URL: http://www.analog.com/static/imported-files/data_sheets/ADM2682E_2687E.pdf; ComponentLink2Description: Datasheet; ComponentLink2URL: http://www.analog.com/static/imported-files/data_sheets/ADM2682E_2687E.pdf; Operating Temperature Range: -40 to 85 degC; PartNumber: ADM2687EBRIZ; Integrated isoPower: Yes; ComponentLink1Description: Manufacturer URL; ComponentLink1URL: http://www.analog.com/; ComponentLink3Description: Package Specification; Package: 16-Lead SOIC; PackageReference: RI-16-2

## Sheet SerialCommunication1.SchDoc
size A3; SheetNumber: 9; SheetTotal: 11
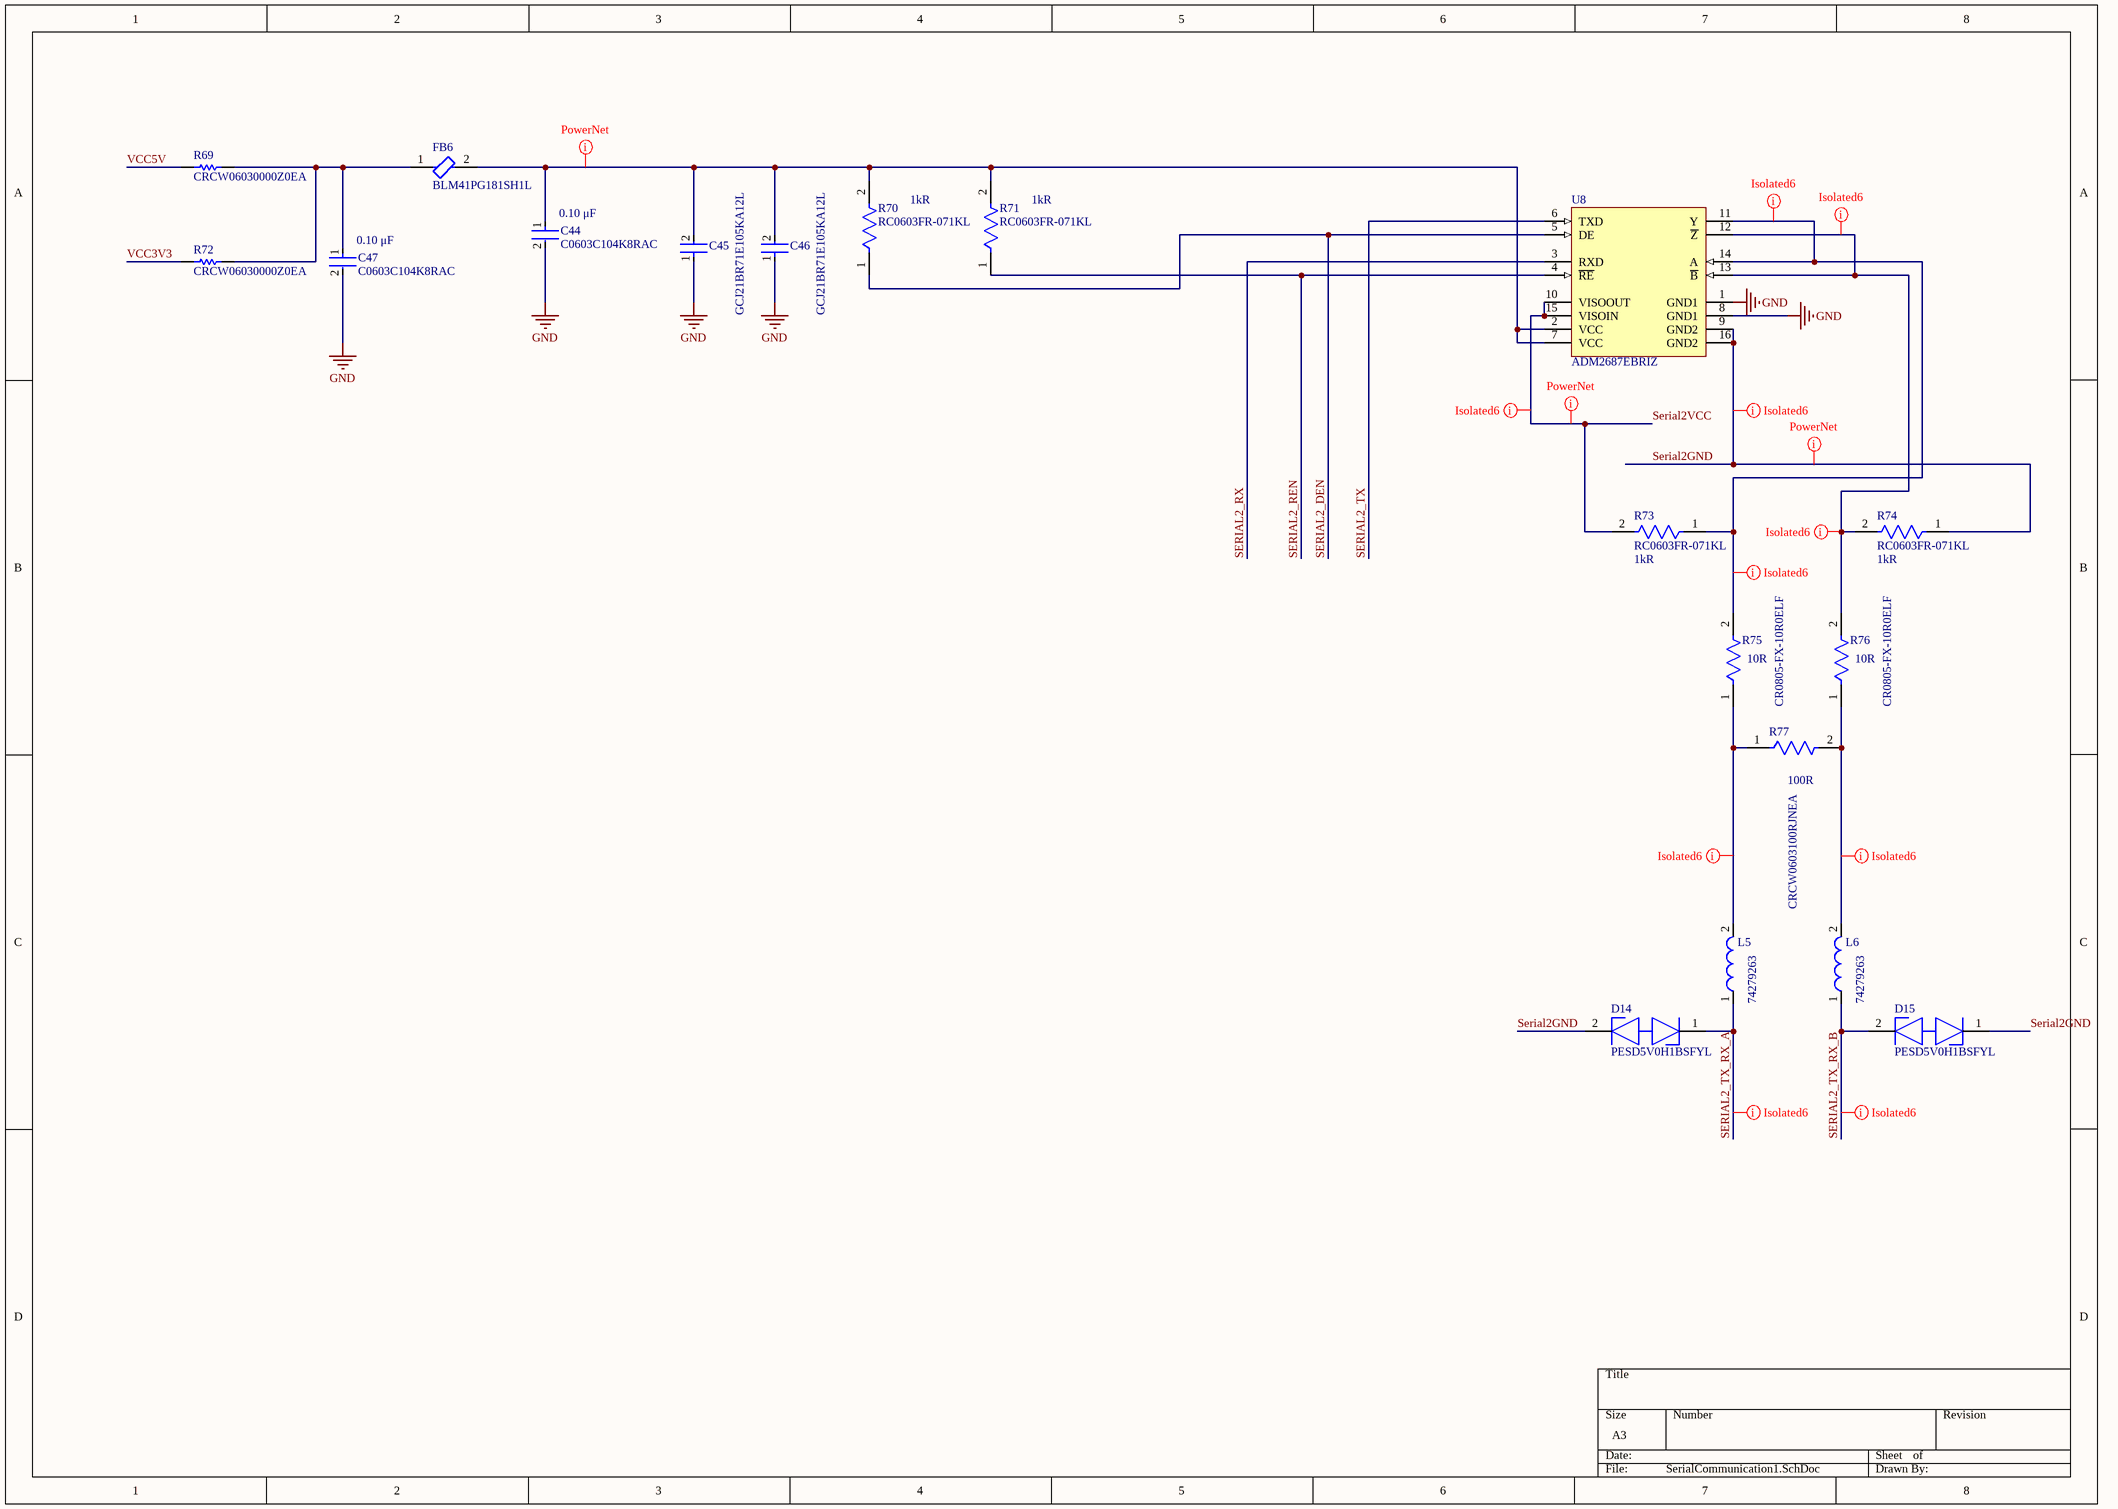
[diagram p8: SerialCommunication1.SchDoc]

### Parts
C44  C0603C104K8RAC  Capacitance: 0.10 μF  [FP-C0603C-CF-MFG]
C45  GCJ21BR71E105KA12L  [FP-GCJ21B-0_3-MFG]
C46  GCJ21BR71E105KA12L  [FP-GCJ21B-0_3-MFG]
C47  C0603C104K8RAC  Capacitance: 0.10 μF  [FP-C0603C-CF-MFG]
D14  PESD5V0H1BSFYL  [FP-SOD962-2-MFG]
D15  PESD5V0H1BSFYL  [FP-SOD962-2-MFG]
FB6  BLM41PG181SH1L  [FP-BLM41-0_2-a1_2-MFG]
L5  74279263  [SMD-0603]
L6  74279263  [SMD-0603]
R69  CRCW06030000Z0EA  [RESC1609X50X30NL8T20]
R70  RC0603FR-071KL  Resistance: 1kR  [FP-RC0603-0_55-IPC_C]
R71  RC0603FR-071KL  Resistance: 1kR  [FP-RC0603-0_55-IPC_C]
R72  CRCW06030000Z0EA  [RESC1609X50X30NL8T20]
R73  RC0603FR-071KL  Resistance: 1kR  [FP-RC0603-0_55-IPC_C]
R74  RC0603FR-071KL  Resistance: 1kR  [FP-RC0603-0_55-IPC_C]
R75  CR0805-FX-10R0ELF  Resistance: 10R  [FP-CR0805-IPC_B]
R76  CR0805-FX-10R0ELF  Resistance: 10R  [FP-CR0805-IPC_B]
R77  CRCW0603100RJNEA  Resistance: 100R  [FP-CRCW0603-e3-IPC_B]
U8  ADM2687EBRIZ  [ADI-RI-16-2_L]

### Nets
GND: C44.2 C45.1 C46.1 C47.2 U8.1(GND1) U8.8(GND1)
SERIAL2_DEN: R70.1 U8.5(DE)
SERIAL2_REN: R71.1 U8.4(~{RE})
SERIAL2_RX: U8.3(RXD)
SERIAL2_TX: U8.6(TXD)
SERIAL2_TX_RX_A: D14.1(K1) L5.1
SERIAL2_TX_RX_B: D15.2(K2) L6.1
Serial2GND: D14.2(K2) D15.1(K1) R74.1 U8.9(GND2) U8.16(GND2)
Serial2VCC: R73.2 U8.10(VISOOUT) U8.15(VISOIN)
VCC3V3: R72.1
VCC5V: R69.1
NetC44_1: C44.1 C45.2 C46.2 FB6.2 R70.2 R71.2 U8.2(VCC) U8.7(VCC)
NetC47_1: C47.1 FB6.1 R69.2 R72.2
NetL5_2: L5.2 R75.1 R77.1
NetL6_2: L6.2 R76.1 R77.2
NetR73_1: R73.1 R75.2 U8.11(Y) U8.14(A)
NetR74_2: R74.2 R76.2 U8.12(~{Z}) U8.13(~{B})

### Layout directives
net class Isolated6: NetL5_2, NetL6_2, NetR73_1, NetR74_2, SERIAL2_TX_RX_A, SERIAL2_TX_RX_B, Serial2GND, Serial2VCC
net class Power: NetC44_1, Serial2GND, Serial2VCC

### Library data of the parts
C44 C47 = CMP-03020-006081-2: as C32 on sheet AnalogInputs; Automotive: Yes; Device Class L2: Capacitors; Height: 0.87mm; Temperature Range High: +125°C; Temperature Coefficient: 30ppm/°C; Temperature Range Low: -55°C; Package: C0603C-CF; Lead Free: Yes; Octopart: https://octopart.com/c0603c104k8rac-kemet-1325403; Manufacturer Part Number: C0603C104K8RAC; Temperature: -55°C to +125°C; Mouser Description: .1UF 10V 10% 0603; RoHS: TRUE; ComponentLink2URL: https://api.kemet.com/component-edge/download/datasheet/C0603C100J5GACAUTO.pdf; ComponentLink2Description: Datasheet; Temperature Characteristic: X7R; Device Class L1: Passive Components; Category: Cap; Device Class L3: Ceramic Capacitors
C45 C46 = CMP-2007-03211-2: as C41 on sheet SerialCommunication; Package Quantity: 3000; Depth: 1.25mm; Packaging: Tape and Reel; Voltage Rating: 25V; Max Operating Temperature: 125°C; Ratings: AEC-Q200; Width: 1.25mm; Min Operating Temperature: -55°C; Termination: SMD/SMT; Lead Free: Lead Free; Dielectric: X7R; Length: 2mm; Thickness: 0.057inch; Capacitance: 1uF; Tolerance: 10%; Case Code (Metric): 2012; Case/Package: 0805; Mount: Surface Mount; Features: Soft Termination; Case Code (Imperial): 0805
D14 D15 = CMP-14436-000004-1: as D12 on sheet SerialCommunication; Lead Free: Yes; Reverse Standoff Voltage: 5V; Footprint Url: https://assets.nexperia.com/documents/outline-drawing/SOD962-2.pdf; ComponentLink2Description: Datasheet; Height: 0.32mm; Ambient Temperature Range Low: -40°C; Manufacturer Part Number: PESD5V0H1BSFYL; Octopart: https://octopart.com/pesd5v0h1bsfyl-nexperia-78741149; Ambient Temperature Range High: +125°C; RoHS: TRUE; Temperature: to +150°C; Capacitance: 0.15pF; ComponentLink2URL: https://assets.nexperia.com/documents/data-sheet/PESD5V0H1BSF.pdf; Temperature Range High: +150°C; Device Class L2: TVS Diodes; Digikey Description: TVS DIODE 5V 5V DSN0603-2; Category: Diode; Device Class L3: unset; Device Class L1: Circuit Protection; Package: SOD962-2; Automotive: No
FB6 = CMP-06046-002023-1: as FB4 on sheet AnalogInputs; Mount: Surface Mount; Length: 4.5mm; Tolerance: 25%; Series: EMIFIL®, BLM41P; Package Quantity: 2500; Min Operating Temperature: -55°C; Max Operating Temperature: 125°C; Height: 0.071inch; Packaging: Tape and Reel; Contact Plating: Tin; Test Frequency: 100MHz; Ratings: AEC-Q200; Case Code (Metric): 4516; Termination: SMD/SMT; Case Code (Imperial): 1806; Width: 0.063inch; Max Current Rating: 3.5A; Case/Package: 1806
L5 L6 = CMP-0220-00148-1: as L3 on sheet SerialCommunication; PackageVersion: 2009; ComponentLink2URL: http://www.we-online.de/katalog/media/pdf/74279263.pdf; PackageDescription: Chip Inductor, 2-Leads, Body 1.6 x 0.8 mm; PackageReference: SMD-0603; ComponentLink1URL: http://www.we-online.com; ComponentLink2Description: Datasheet; ComponentLink1Description: Manufacturer Link; DatasheetVersion: Dec-2005
R69 R72 = CMP-2000-03816-5: as R60 on sheet SerialCommunication; Package Quantity: 5000; DatasheetVersion: 06/2012; Min Operating Temperature: -55 degC; ComponentLink1URL: http://www.vishay.com/; Mounting Technology: Surface Mount; Height: 0.45 mm; ComponentLink1Description: Manufacturer URL; REACH SVHC: Unknown; PackageReference: 0603; Packaging: Tape and Reel; Max Operating Temperature: 155 degC; Mount: Surface Mount; ComponentLink2Description: Datasheet; PackageDescription: 2-Pin Surface Mount Device, Body 1.575 x 0.85 mm; Length: 1.55 mm; ComponentLink2URL: http://www.vishay.com/docs/20035/dcrcwe3.pdf; Pins: 2; RoHSCompliant: true
R70 R71 R73 R74 = CMP-1659-00009-5: as R61 on sheet SerialCommunication; Military Standard: Not; REACH SVHC: No SVHC; Size Code: 0603; Features: Moisture Resistant; Number of Terminations: 2; Technology: THICK FILM; Series: RC; Case Code (Metric): 1608; Resistance Tolerance: 1%; Resistor Type: Thick Film; Termination: SMD/SMT; Contact Plating: Tin; Radiation Hardening: No; Min Operating Temperature: -55°C; Max Operating Temperature: 155°C; Packaging: Tape and Reel; Max Power Dissipation: 100mW; RoHS Compliant: Yes; Height: 0.45mm; Lead Free: Lead Free; Case/Package: 0603; Length: 1.6mm; Tolerance: 1%; Case Code (Imperial): 0603; Construction: Rectangular; Depth: 0.8mm
R75 R76 = CMP-07231-004657-1: as R66 on sheet SerialCommunication; Tolerance: 1%; Min Operating Temperature: -55°C; Length: 2mm; Case Code (Metric): 2012; Temperature Coefficient: 100ppm/°C; Height: 0.5mm; Max Operating Temperature: 155°C; Case/Package: 0805; Width: 1.25mm; Composition: Thick Film; Contact Plating: Tin; Termination: SMD/SMT; Packaging: Tape and Reel; REACH SVHC: No SVHC; Number of Pins: 2; Package Quantity: 5000; Mount: Surface Mount; Military Standard: Not; Thickness: 508um; Case Code (Imperial): 0805; Depth: 1.25mm; Radiation Hardening: No; Voltage Rating: 150V
R77 = CMP-2000-03827-2: as R68 on sheet SerialCommunication; Weight: 7.1E-05oz; Max Operating Temperature: 155°C; Military Standard: Not; Case Code (Imperial): 0603; Case/Package: 0603; Packaging: Tape and Reel; Number of Terminations: 2; Package Quantity: 1; Radiation Hardening: No; Termination: SMD/SMT; Case Code (Metric): 1608; Min Operating Temperature: -55°C; Height: 0.02inch; Length: 1.55mm; Tolerance: 5%; Width: 0.85mm; Contact Plating: Tin; Max Power Dissipation: 100mW; Features: Automotive AEC-Q200; Composition: Thick Film; Temperature Coefficient: 200ppm/°C; Depth: 0.85mm
U8 = CMP-0528-00004-2: as U7 on sheet SerialCommunication; DataRate RS-485: 500 Kbps; RoHS: TRUE; Mounting Technology: Surface Mount; PackageDescription: 16-Pin Standard Small Outline Package, Body 12.75 x 7.5 mm, Pitch 1.27 mm; DatasheetVersion: Rev. A; ComponentLink3URL: http://www.analog.com/static/imported-files/data_sheets/ADM2682E_2687E.pdf; ComponentLink2Description: Datasheet; ComponentLink2URL: http://www.analog.com/static/imported-files/data_sheets/ADM2682E_2687E.pdf; Operating Temperature Range: -40 to 85 degC; PartNumber: ADM2687EBRIZ; Integrated isoPower: Yes; ComponentLink1Description: Manufacturer URL; ComponentLink1URL: http://www.analog.com/; ComponentLink3Description: Package Specification; Package: 16-Lead SOIC; PackageReference: RI-16-2

## Sheet SerialCommunication2.SchDoc
size A3; SheetNumber: 10; SheetTotal: 11
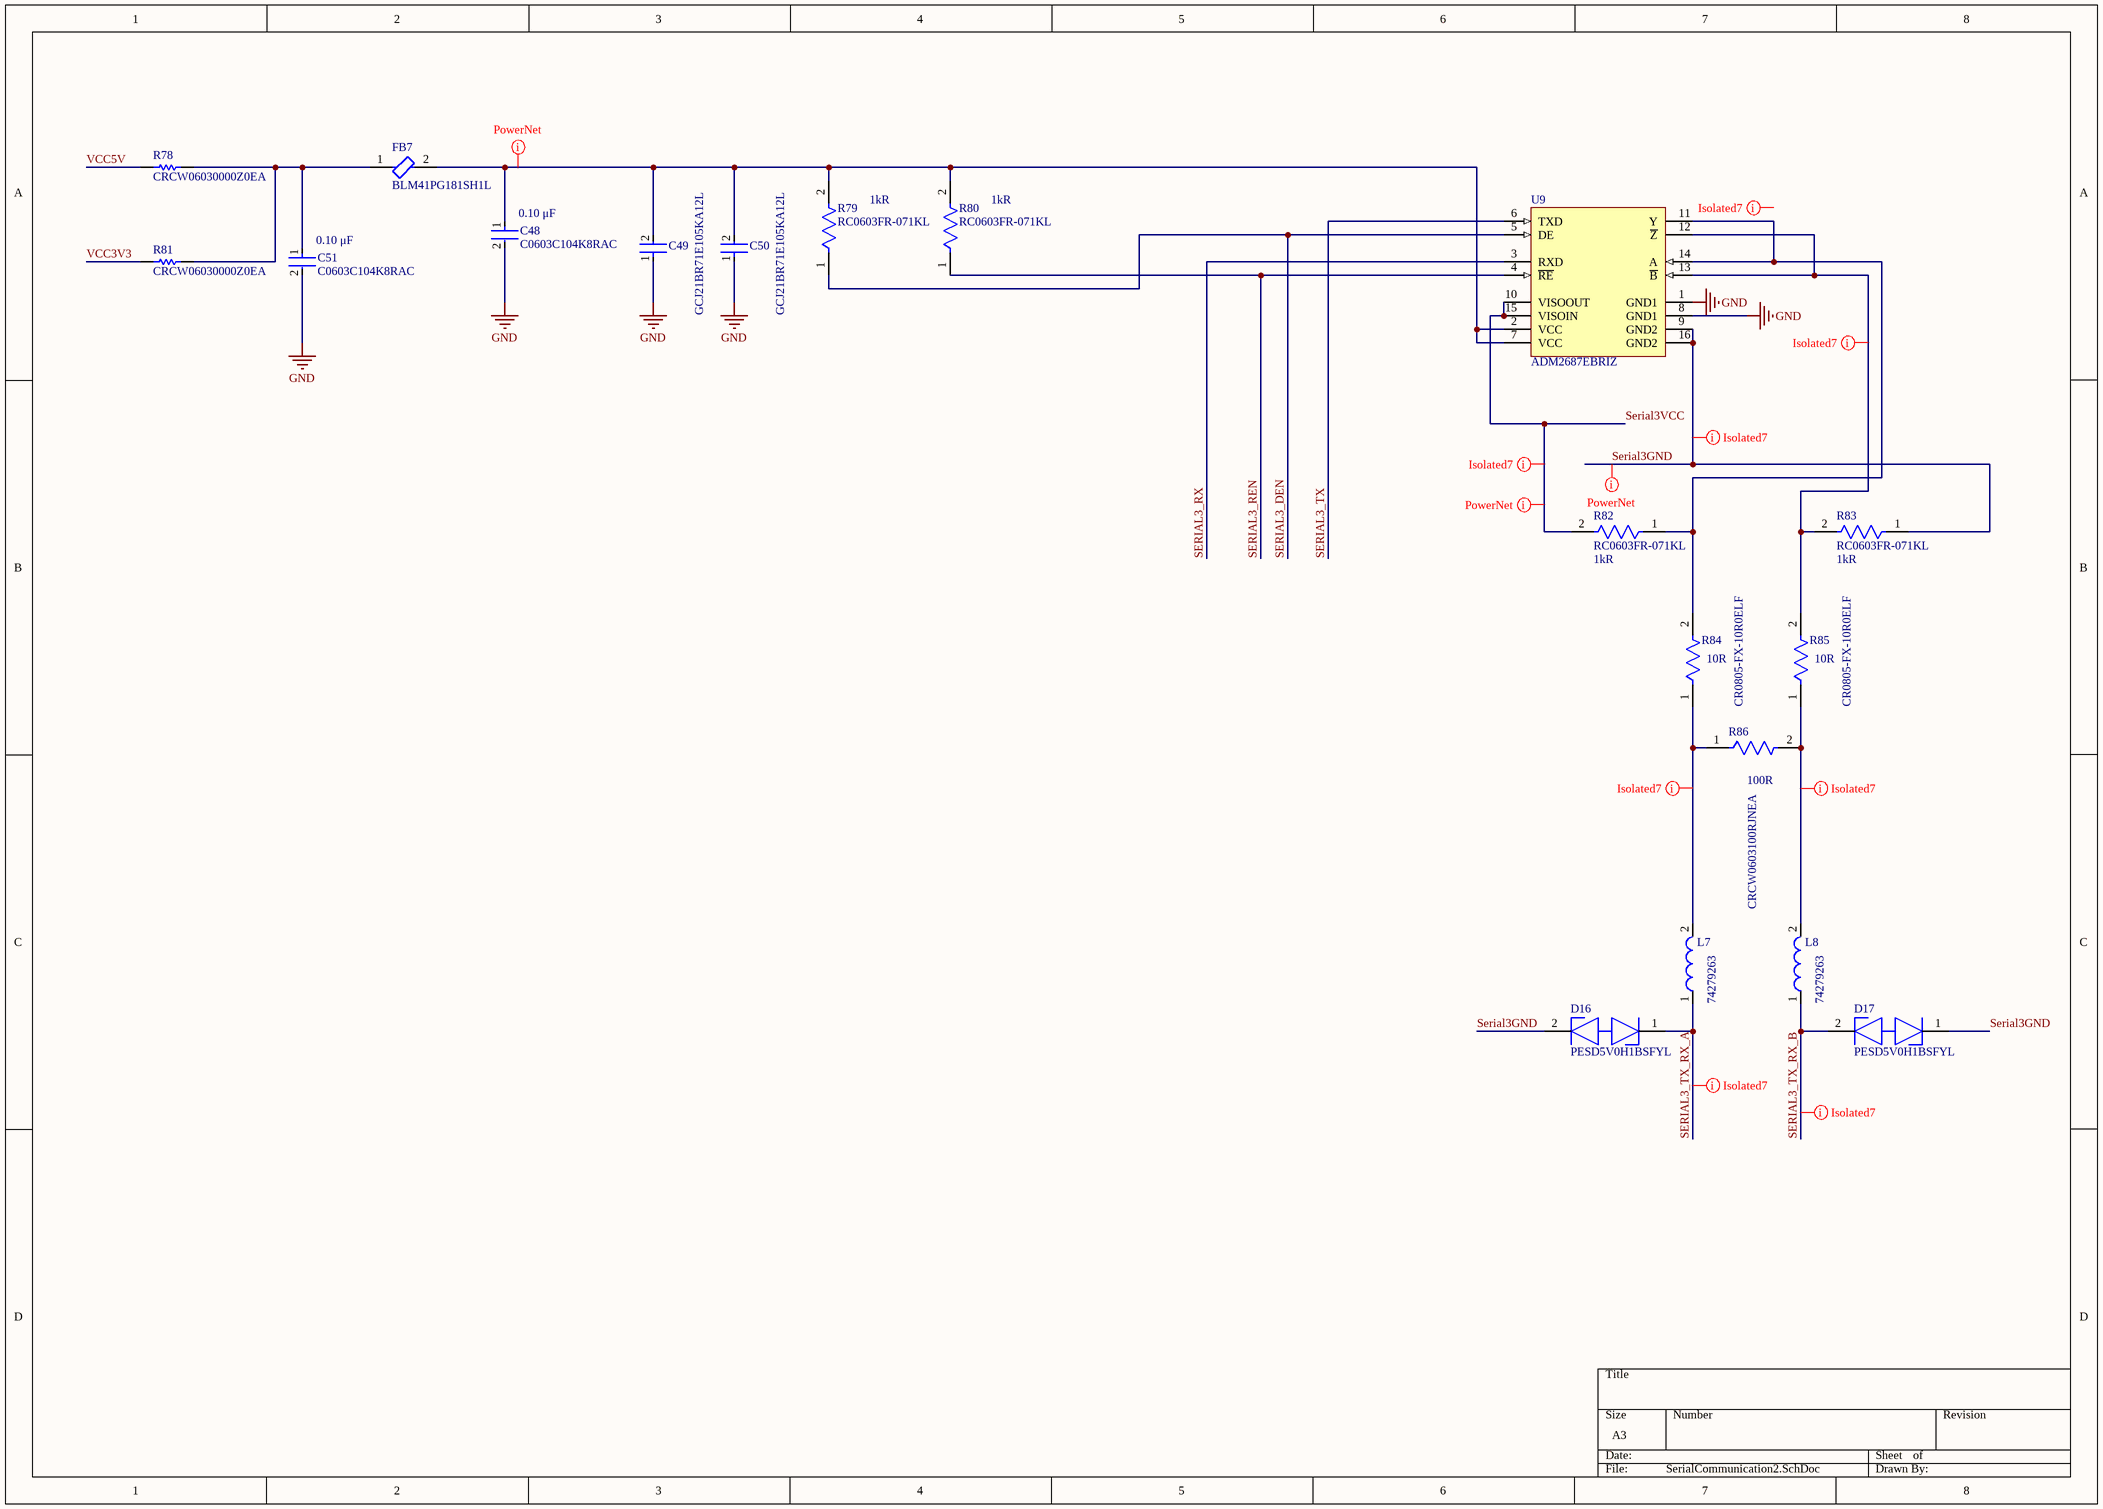
[diagram p9: SerialCommunication2.SchDoc]

### Parts
C48  C0603C104K8RAC  Capacitance: 0.10 μF  [FP-C0603C-CF-MFG]
C49  GCJ21BR71E105KA12L  [FP-GCJ21B-0_3-MFG]
C50  GCJ21BR71E105KA12L  [FP-GCJ21B-0_3-MFG]
C51  C0603C104K8RAC  Capacitance: 0.10 μF  [FP-C0603C-CF-MFG]
D16  PESD5V0H1BSFYL  [FP-SOD962-2-MFG]
D17  PESD5V0H1BSFYL  [FP-SOD962-2-MFG]
FB7  BLM41PG181SH1L  [FP-BLM41-0_2-a1_2-MFG]
L7  74279263  [SMD-0603]
L8  74279263  [SMD-0603]
R78  CRCW06030000Z0EA  [RESC1609X50X30NL8T20]
R79  RC0603FR-071KL  Resistance: 1kR  [FP-RC0603-0_55-IPC_C]
R80  RC0603FR-071KL  Resistance: 1kR  [FP-RC0603-0_55-IPC_C]
R81  CRCW06030000Z0EA  [RESC1609X50X30NL8T20]
R82  RC0603FR-071KL  Resistance: 1kR  [FP-RC0603-0_55-IPC_C]
R83  RC0603FR-071KL  Resistance: 1kR  [FP-RC0603-0_55-IPC_C]
R84  CR0805-FX-10R0ELF  Resistance: 10R  [FP-CR0805-IPC_B]
R85  CR0805-FX-10R0ELF  Resistance: 10R  [FP-CR0805-IPC_B]
R86  CRCW0603100RJNEA  Resistance: 100R  [FP-CRCW0603-e3-IPC_B]
U9  ADM2687EBRIZ  [ADI-RI-16-2_L]

### Nets
GND: C48.2 C49.1 C50.1 C51.2 U9.1(GND1) U9.8(GND1)
SERIAL3_DEN: R79.1 U9.5(DE)
SERIAL3_REN: R80.1 U9.4(~{RE})
SERIAL3_RX: U9.3(RXD)
SERIAL3_TX: U9.6(TXD)
SERIAL3_TX_RX_A: D16.1(K1) L7.1
SERIAL3_TX_RX_B: D17.2(K2) L8.1
Serial3GND: D16.2(K2) D17.1(K1) R83.1 U9.9(GND2) U9.16(GND2)
Serial3VCC: R82.2 U9.10(VISOOUT) U9.15(VISOIN)
VCC3V3: R81.1
VCC5V: R78.1
NetC48_1: C48.1 C49.2 C50.2 FB7.2 R79.2 R80.2 U9.2(VCC) U9.7(VCC)
NetC51_1: C51.1 FB7.1 R78.2 R81.2
NetL7_2: L7.2 R84.1 R86.1
NetL8_2: L8.2 R85.1 R86.2
NetR82_1: R82.1 R84.2 U9.11(Y) U9.14(A)
NetR83_2: R83.2 R85.2 U9.12(~{Z}) U9.13(~{B})

### Layout directives
net class Isolated7: (no net found under the mark), NetL7_2, NetL8_2, NetR83_2, SERIAL3_TX_RX_A, SERIAL3_TX_RX_B, Serial3GND, Serial3VCC
net class Power: NetC48_1, Serial3GND, Serial3VCC

### Library data of the parts
C48 C51 = CMP-03020-006081-2: as C32 on sheet AnalogInputs; Automotive: Yes; Device Class L2: Capacitors; Height: 0.87mm; Temperature Range High: +125°C; Temperature Coefficient: 30ppm/°C; Temperature Range Low: -55°C; Package: C0603C-CF; Lead Free: Yes; Octopart: https://octopart.com/c0603c104k8rac-kemet-1325403; Manufacturer Part Number: C0603C104K8RAC; Temperature: -55°C to +125°C; Mouser Description: .1UF 10V 10% 0603; RoHS: TRUE; ComponentLink2URL: https://api.kemet.com/component-edge/download/datasheet/C0603C100J5GACAUTO.pdf; ComponentLink2Description: Datasheet; Temperature Characteristic: X7R; Device Class L1: Passive Components; Category: Cap; Device Class L3: Ceramic Capacitors
C49 C50 = CMP-2007-03211-2: as C41 on sheet SerialCommunication; Package Quantity: 3000; Depth: 1.25mm; Packaging: Tape and Reel; Voltage Rating: 25V; Max Operating Temperature: 125°C; Ratings: AEC-Q200; Width: 1.25mm; Min Operating Temperature: -55°C; Termination: SMD/SMT; Lead Free: Lead Free; Dielectric: X7R; Length: 2mm; Thickness: 0.057inch; Capacitance: 1uF; Tolerance: 10%; Case Code (Metric): 2012; Case/Package: 0805; Mount: Surface Mount; Features: Soft Termination; Case Code (Imperial): 0805
D16 D17 = CMP-14436-000004-1: as D12 on sheet SerialCommunication; Lead Free: Yes; Reverse Standoff Voltage: 5V; Footprint Url: https://assets.nexperia.com/documents/outline-drawing/SOD962-2.pdf; ComponentLink2Description: Datasheet; Height: 0.32mm; Ambient Temperature Range Low: -40°C; Manufacturer Part Number: PESD5V0H1BSFYL; Octopart: https://octopart.com/pesd5v0h1bsfyl-nexperia-78741149; Ambient Temperature Range High: +125°C; RoHS: TRUE; Temperature: to +150°C; Capacitance: 0.15pF; ComponentLink2URL: https://assets.nexperia.com/documents/data-sheet/PESD5V0H1BSF.pdf; Temperature Range High: +150°C; Device Class L2: TVS Diodes; Digikey Description: TVS DIODE 5V 5V DSN0603-2; Category: Diode; Device Class L3: unset; Device Class L1: Circuit Protection; Package: SOD962-2; Automotive: No
FB7 = CMP-06046-002023-1: as FB4 on sheet AnalogInputs; Mount: Surface Mount; Length: 4.5mm; Tolerance: 25%; Series: EMIFIL®, BLM41P; Package Quantity: 2500; Min Operating Temperature: -55°C; Max Operating Temperature: 125°C; Height: 0.071inch; Packaging: Tape and Reel; Contact Plating: Tin; Test Frequency: 100MHz; Ratings: AEC-Q200; Case Code (Metric): 4516; Termination: SMD/SMT; Case Code (Imperial): 1806; Width: 0.063inch; Max Current Rating: 3.5A; Case/Package: 1806
L7 L8 = CMP-0220-00148-1: as L3 on sheet SerialCommunication; PackageVersion: 2009; ComponentLink2URL: http://www.we-online.de/katalog/media/pdf/74279263.pdf; PackageDescription: Chip Inductor, 2-Leads, Body 1.6 x 0.8 mm; PackageReference: SMD-0603; ComponentLink1URL: http://www.we-online.com; ComponentLink2Description: Datasheet; ComponentLink1Description: Manufacturer Link; DatasheetVersion: Dec-2005
R78 R81 = CMP-2000-03816-5: as R60 on sheet SerialCommunication; Package Quantity: 5000; DatasheetVersion: 06/2012; Min Operating Temperature: -55 degC; ComponentLink1URL: http://www.vishay.com/; Mounting Technology: Surface Mount; Height: 0.45 mm; ComponentLink1Description: Manufacturer URL; REACH SVHC: Unknown; PackageReference: 0603; Packaging: Tape and Reel; Max Operating Temperature: 155 degC; Mount: Surface Mount; ComponentLink2Description: Datasheet; PackageDescription: 2-Pin Surface Mount Device, Body 1.575 x 0.85 mm; Length: 1.55 mm; ComponentLink2URL: http://www.vishay.com/docs/20035/dcrcwe3.pdf; Pins: 2; RoHSCompliant: true
R79 R80 R82 R83 = CMP-1659-00009-5: as R61 on sheet SerialCommunication; Military Standard: Not; REACH SVHC: No SVHC; Size Code: 0603; Features: Moisture Resistant; Number of Terminations: 2; Technology: THICK FILM; Series: RC; Case Code (Metric): 1608; Resistance Tolerance: 1%; Resistor Type: Thick Film; Termination: SMD/SMT; Contact Plating: Tin; Radiation Hardening: No; Min Operating Temperature: -55°C; Max Operating Temperature: 155°C; Packaging: Tape and Reel; Max Power Dissipation: 100mW; RoHS Compliant: Yes; Height: 0.45mm; Lead Free: Lead Free; Case/Package: 0603; Length: 1.6mm; Tolerance: 1%; Case Code (Imperial): 0603; Construction: Rectangular; Depth: 0.8mm
R84 R85 = CMP-07231-004657-1: as R66 on sheet SerialCommunication; Tolerance: 1%; Min Operating Temperature: -55°C; Length: 2mm; Case Code (Metric): 2012; Temperature Coefficient: 100ppm/°C; Height: 0.5mm; Max Operating Temperature: 155°C; Case/Package: 0805; Width: 1.25mm; Composition: Thick Film; Contact Plating: Tin; Termination: SMD/SMT; Packaging: Tape and Reel; REACH SVHC: No SVHC; Number of Pins: 2; Package Quantity: 5000; Mount: Surface Mount; Military Standard: Not; Thickness: 508um; Case Code (Imperial): 0805; Depth: 1.25mm; Radiation Hardening: No; Voltage Rating: 150V
R86 = CMP-2000-03827-2: as R68 on sheet SerialCommunication; Weight: 7.1E-05oz; Max Operating Temperature: 155°C; Military Standard: Not; Case Code (Imperial): 0603; Case/Package: 0603; Packaging: Tape and Reel; Number of Terminations: 2; Package Quantity: 1; Radiation Hardening: No; Termination: SMD/SMT; Case Code (Metric): 1608; Min Operating Temperature: -55°C; Height: 0.02inch; Length: 1.55mm; Tolerance: 5%; Width: 0.85mm; Contact Plating: Tin; Max Power Dissipation: 100mW; Features: Automotive AEC-Q200; Composition: Thick Film; Temperature Coefficient: 200ppm/°C; Depth: 0.85mm
U9 = CMP-0528-00004-2: as U7 on sheet SerialCommunication; DataRate RS-485: 500 Kbps; RoHS: TRUE; Mounting Technology: Surface Mount; PackageDescription: 16-Pin Standard Small Outline Package, Body 12.75 x 7.5 mm, Pitch 1.27 mm; DatasheetVersion: Rev. A; ComponentLink3URL: http://www.analog.com/static/imported-files/data_sheets/ADM2682E_2687E.pdf; ComponentLink2Description: Datasheet; ComponentLink2URL: http://www.analog.com/static/imported-files/data_sheets/ADM2682E_2687E.pdf; Operating Temperature Range: -40 to 85 degC; PartNumber: ADM2687EBRIZ; Integrated isoPower: Yes; ComponentLink1Description: Manufacturer URL; ComponentLink1URL: http://www.analog.com/; ComponentLink3Description: Package Specification; Package: 16-Lead SOIC; PackageReference: RI-16-2

## Sheet CANBUS.SchDoc
size A3; SheetNumber: 11; SheetTotal: 11
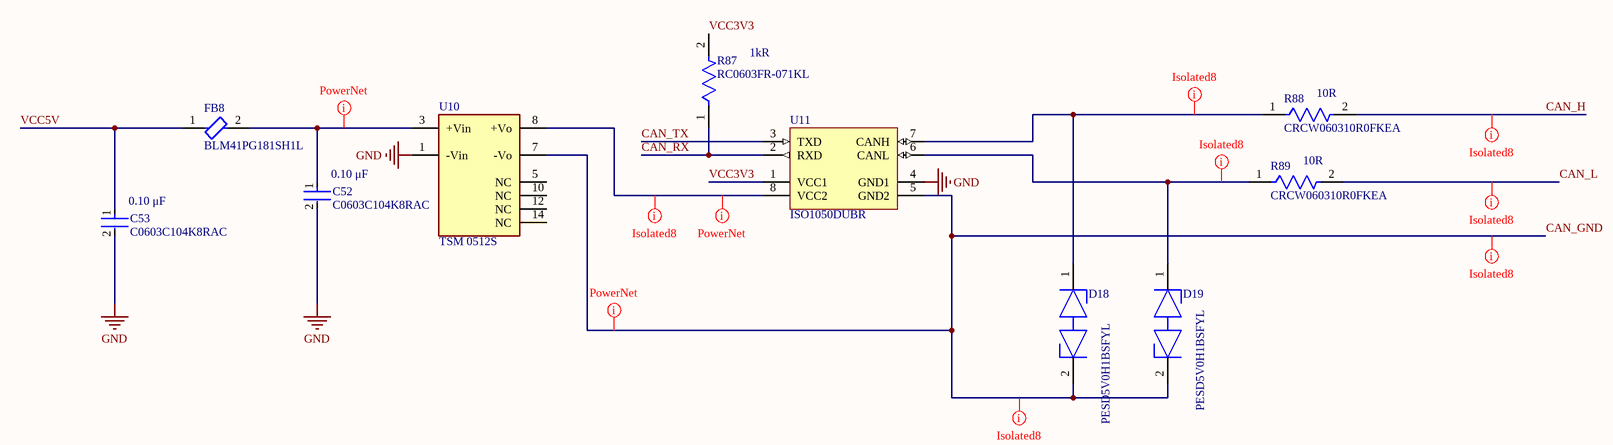
[diagram p10: CANBUS.SchDoc]

### Parts
C52  C0603C104K8RAC  Capacitance: 0.10 μF  [FP-C0603C-CF-MFG]
C53  C0603C104K8RAC  Capacitance: 0.10 μF  [FP-C0603C-CF-MFG]
D18  PESD5V0H1BSFYL  [FP-SOD962-2-MFG]
D19  PESD5V0H1BSFYL  [FP-SOD962-2-MFG]
FB8  BLM41PG181SH1L  [FP-BLM41-0_2-a1_2-MFG]
R87  RC0603FR-071KL  Resistance: 1kR  [FP-RC0603-0_55-IPC_C]
R88  CRCW060310R0FKEA  Resistance: 10R  [FP-CRCW0603-e3-IPC_A]
R89  CRCW060310R0FKEA  Resistance: 10R  [FP-CRCW0603-e3-IPC_A]
U10  TSM 0512S  [FP-TSM_0512S-MFG]
U11  ISO1050DUBR  [DUB0008A_L]

### Nets
GND: C52.2 C53.2 U10.1(-Vin) U11.4(GND1)
CAN_GND: D18.2(K2) D19.2(K2) U10.7(-Vo) U11.5(GND2)
CAN_H: R88.2
CAN_L: R89.2
CAN_RX: R87.1 U11.2(RXD)
CAN_TX: U11.3(TXD)
VCC3V3: R87.2 U11.1(VCC1)
VCC5V: C53.1 FB8.1
NetC52_1: C52.1 FB8.2 U10.3(+Vin)
NetD18_1: D18.1(K1) R88.1 U11.7(CANH)
NetD19_1: D19.1(K1) R89.1 U11.6(CANL)
NetU10_8: U10.8(+Vo) U11.8(VCC2)

Not connected (* = marked no-connect by the designer): U10 5(NC) 10(NC) 12(NC) 14(NC)

### Layout directives
net class Isolated8: CAN_GND, CAN_H, CAN_L, NetD18_1, NetD19_1, NetU10_8
net class Power: CAN_GND, NetC52_1, NetU10_8

### Library data of the parts
C52 C53 = CMP-03020-006081-2: as C32 on sheet AnalogInputs; Automotive: Yes; Device Class L2: Capacitors; Height: 0.87mm; Temperature Range High: +125°C; Temperature Coefficient: 30ppm/°C; Temperature Range Low: -55°C; Package: C0603C-CF; Lead Free: Yes; Octopart: https://octopart.com/c0603c104k8rac-kemet-1325403; Manufacturer Part Number: C0603C104K8RAC; Temperature: -55°C to +125°C; Mouser Description: .1UF 10V 10% 0603; RoHS: TRUE; ComponentLink2URL: https://api.kemet.com/component-edge/download/datasheet/C0603C100J5GACAUTO.pdf; ComponentLink2Description: Datasheet; Temperature Characteristic: X7R; Device Class L1: Passive Components; Category: Cap; Device Class L3: Ceramic Capacitors
D18 D19 = CMP-14436-000004-1: as D12 on sheet SerialCommunication; Lead Free: Yes; Reverse Standoff Voltage: 5V; Footprint Url: https://assets.nexperia.com/documents/outline-drawing/SOD962-2.pdf; ComponentLink2Description: Datasheet; Height: 0.32mm; Ambient Temperature Range Low: -40°C; Manufacturer Part Number: PESD5V0H1BSFYL; Octopart: https://octopart.com/pesd5v0h1bsfyl-nexperia-78741149; Ambient Temperature Range High: +125°C; RoHS: TRUE; Temperature: to +150°C; Capacitance: 0.15pF; ComponentLink2URL: https://assets.nexperia.com/documents/data-sheet/PESD5V0H1BSF.pdf; Temperature Range High: +150°C; Device Class L2: TVS Diodes; Digikey Description: TVS DIODE 5V 5V DSN0603-2; Category: Diode; Device Class L3: unset; Device Class L1: Circuit Protection; Package: SOD962-2; Automotive: No
FB8 = CMP-06046-002023-1: as FB4 on sheet AnalogInputs; Mount: Surface Mount; Length: 4.5mm; Tolerance: 25%; Series: EMIFIL®, BLM41P; Package Quantity: 2500; Min Operating Temperature: -55°C; Max Operating Temperature: 125°C; Height: 0.071inch; Packaging: Tape and Reel; Contact Plating: Tin; Test Frequency: 100MHz; Ratings: AEC-Q200; Case Code (Metric): 4516; Termination: SMD/SMT; Case Code (Imperial): 1806; Width: 0.063inch; Max Current Rating: 3.5A; Case/Package: 1806
R87 = CMP-1659-00009-5: as R61 on sheet SerialCommunication; Military Standard: Not; REACH SVHC: No SVHC; Size Code: 0603; Features: Moisture Resistant; Number of Terminations: 2; Technology: THICK FILM; Series: RC; Case Code (Metric): 1608; Resistance Tolerance: 1%; Resistor Type: Thick Film; Termination: SMD/SMT; Contact Plating: Tin; Radiation Hardening: No; Min Operating Temperature: -55°C; Max Operating Temperature: 155°C; Packaging: Tape and Reel; Max Power Dissipation: 100mW; RoHS Compliant: Yes; Height: 0.45mm; Lead Free: Lead Free; Case/Package: 0603; Length: 1.6mm; Tolerance: 1%; Case Code (Imperial): 0603; Construction: Rectangular; Depth: 0.8mm
R88 R89 = CMP-2000-03845-2: RES Thick Film, 10Ω, 1%, 0.1W, 100ppm/°C, 0603; Voltage Rating (DC): 75V; Power Rating: 100mW; Depth: 0.85mm; Height: 0.45mm; Package Quantity: 10; Temperature Coefficient: 100ppm/°C; Weight: 7.1E-05oz; Case Code (Metric): 1608; Number of Terminations: 2; Features: Automotive AEC-Q200; Termination: SMD/SMT; Lead Free: Lead Free; Mount: Surface Mount; Number of Pins: 2; Tolerance: 1%; Max Power Dissipation: 100mW; Width: 0.033inch; Contact Plating: Tin; Case Code (Imperial): 0603; Max Operating Temperature: 155°C; Min Operating Temperature: -55°C; Voltage Rating: 75V; Length: 1.55mm; Case/Package: 0603; Composition: Thick Film; Packaging: Tape and Reel; Military Standard: Not
U10 = CMP-49942-000007-1: as U4 on sheet AnalogInputs; Octopart: https://octopart.com/tsm+0512s-tracopower-7394392; Manufacturer Part Number: TSM 0512S; ComponentLink2URL: https://docs.rs-online.com/a71b/0900766b816ed9c3.pdf; Lead Free: Yes; Temperature: -40°C to +85°C; Device Class L3: Voltage Regulators - Switching; Output Voltage: 12V; Temperature Range High: +85°C; Height: 7.55mm; RoHS: TRUE; Device Class L2: Power Management ICs; Digikey Description: DC DC CONVERTER 12V 960MW; ComponentLink2Description: Datasheet; Automotive: No; Category: IC; Temperature Range Low: -40°C; Device Class L1: Integrated Circuits (ICs); Package: 0
U11 = CMP-0315-00093-2: Isolated CAN Transceiver, -55 to 105 degC, 8-pin SOP (DUB), Green (RoHS & no Sb/Br); Manufacturer: Texas Instruments; Rating: Catalog; Isolated: Yes; Drivers Per Package: 1; PackageReference: DUB0008A; PartNumber: ISO1050DUBR; ComponentLink2Description: Package Specification; ComponentLink1Description: Datasheet; Mounting Technology: Surface Mount; ComponentLink1URL: http://www.ti.com/general/docs/lit/getliterature.tsp?genericPartNumber=ISO1050&fileType=pdf; ComponentLink2URL: http://www.ti.com/litv/pdf/mpds247b; Eco-Plan: Green (RoHS & no Sb/Br); PackageDescription: 8-Pin Small Outline Package 2.54 mm Pitch; PackageVersion: revC, May-2006; SubFamily: CAN; DatasheetVersion: SLLS983E